# Altium schematic sheet PMSM_Driver.SchDoc
size 1249 x 800 mm; SheetNumber: 1; SheetTotal: 1
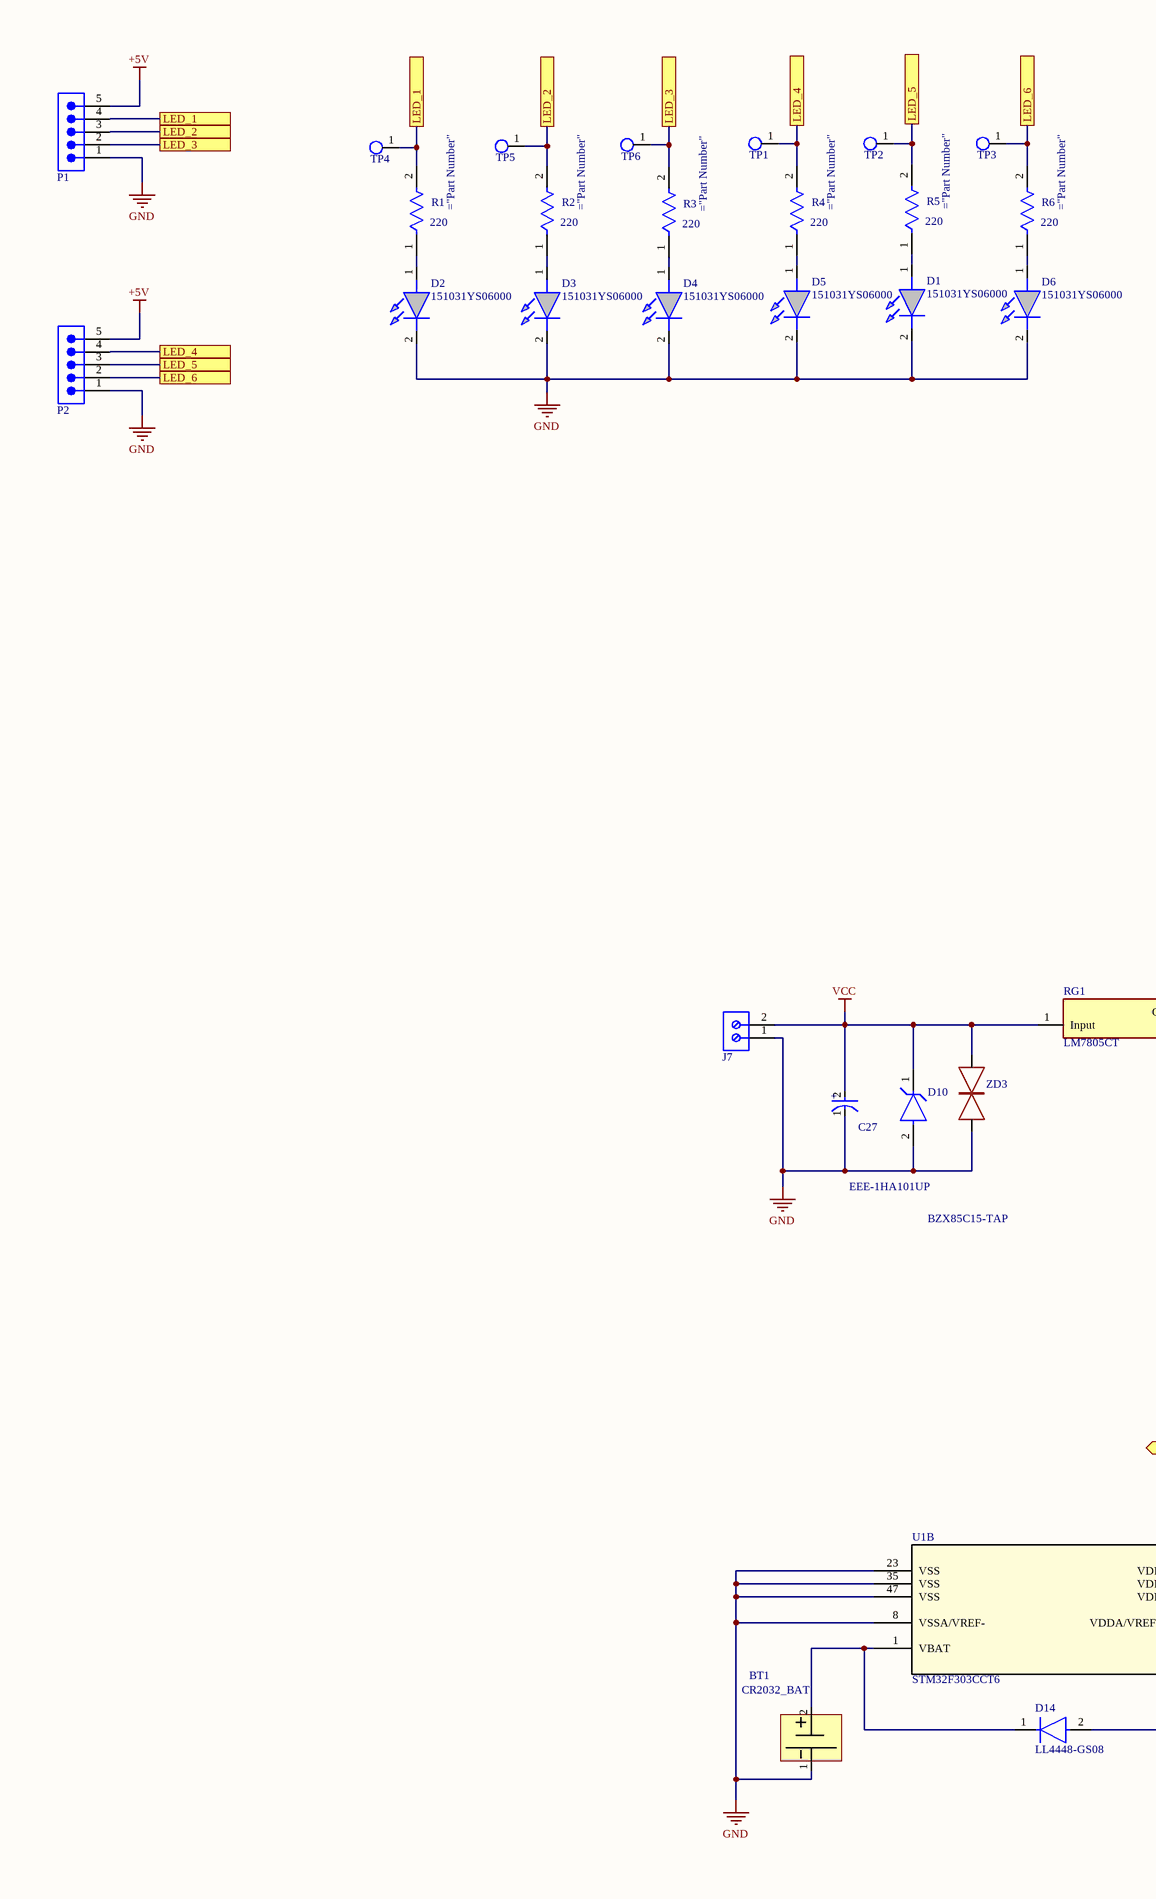
[diagram p0: PMSM_Driver.SchDoc, top column 1 of 4]
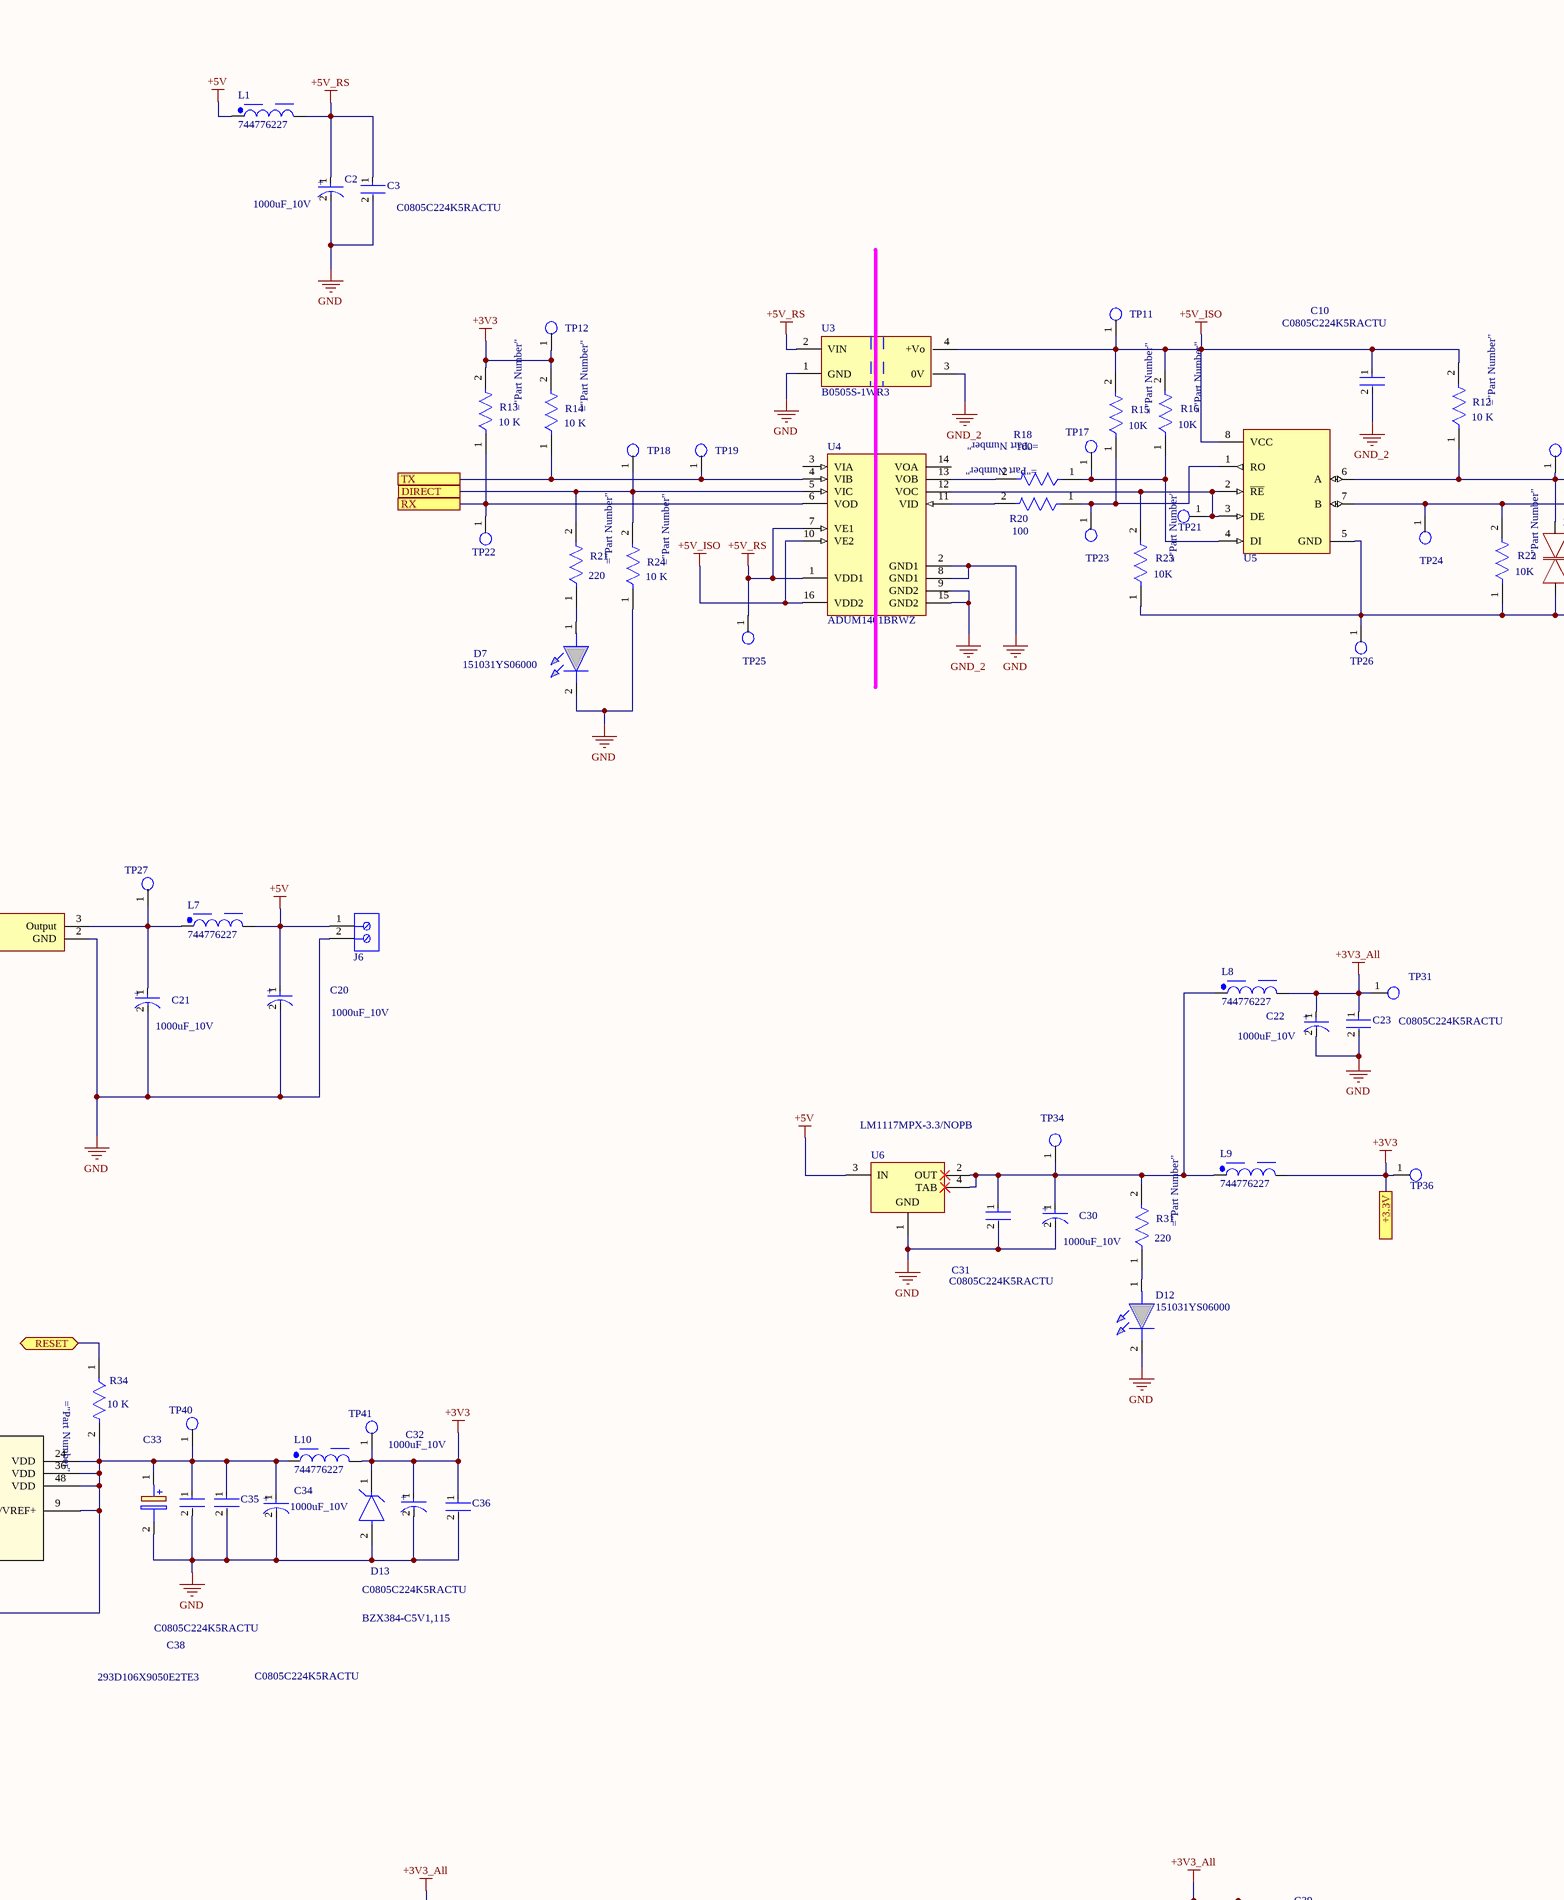
[diagram p1: PMSM_Driver.SchDoc, top column 2 of 4]
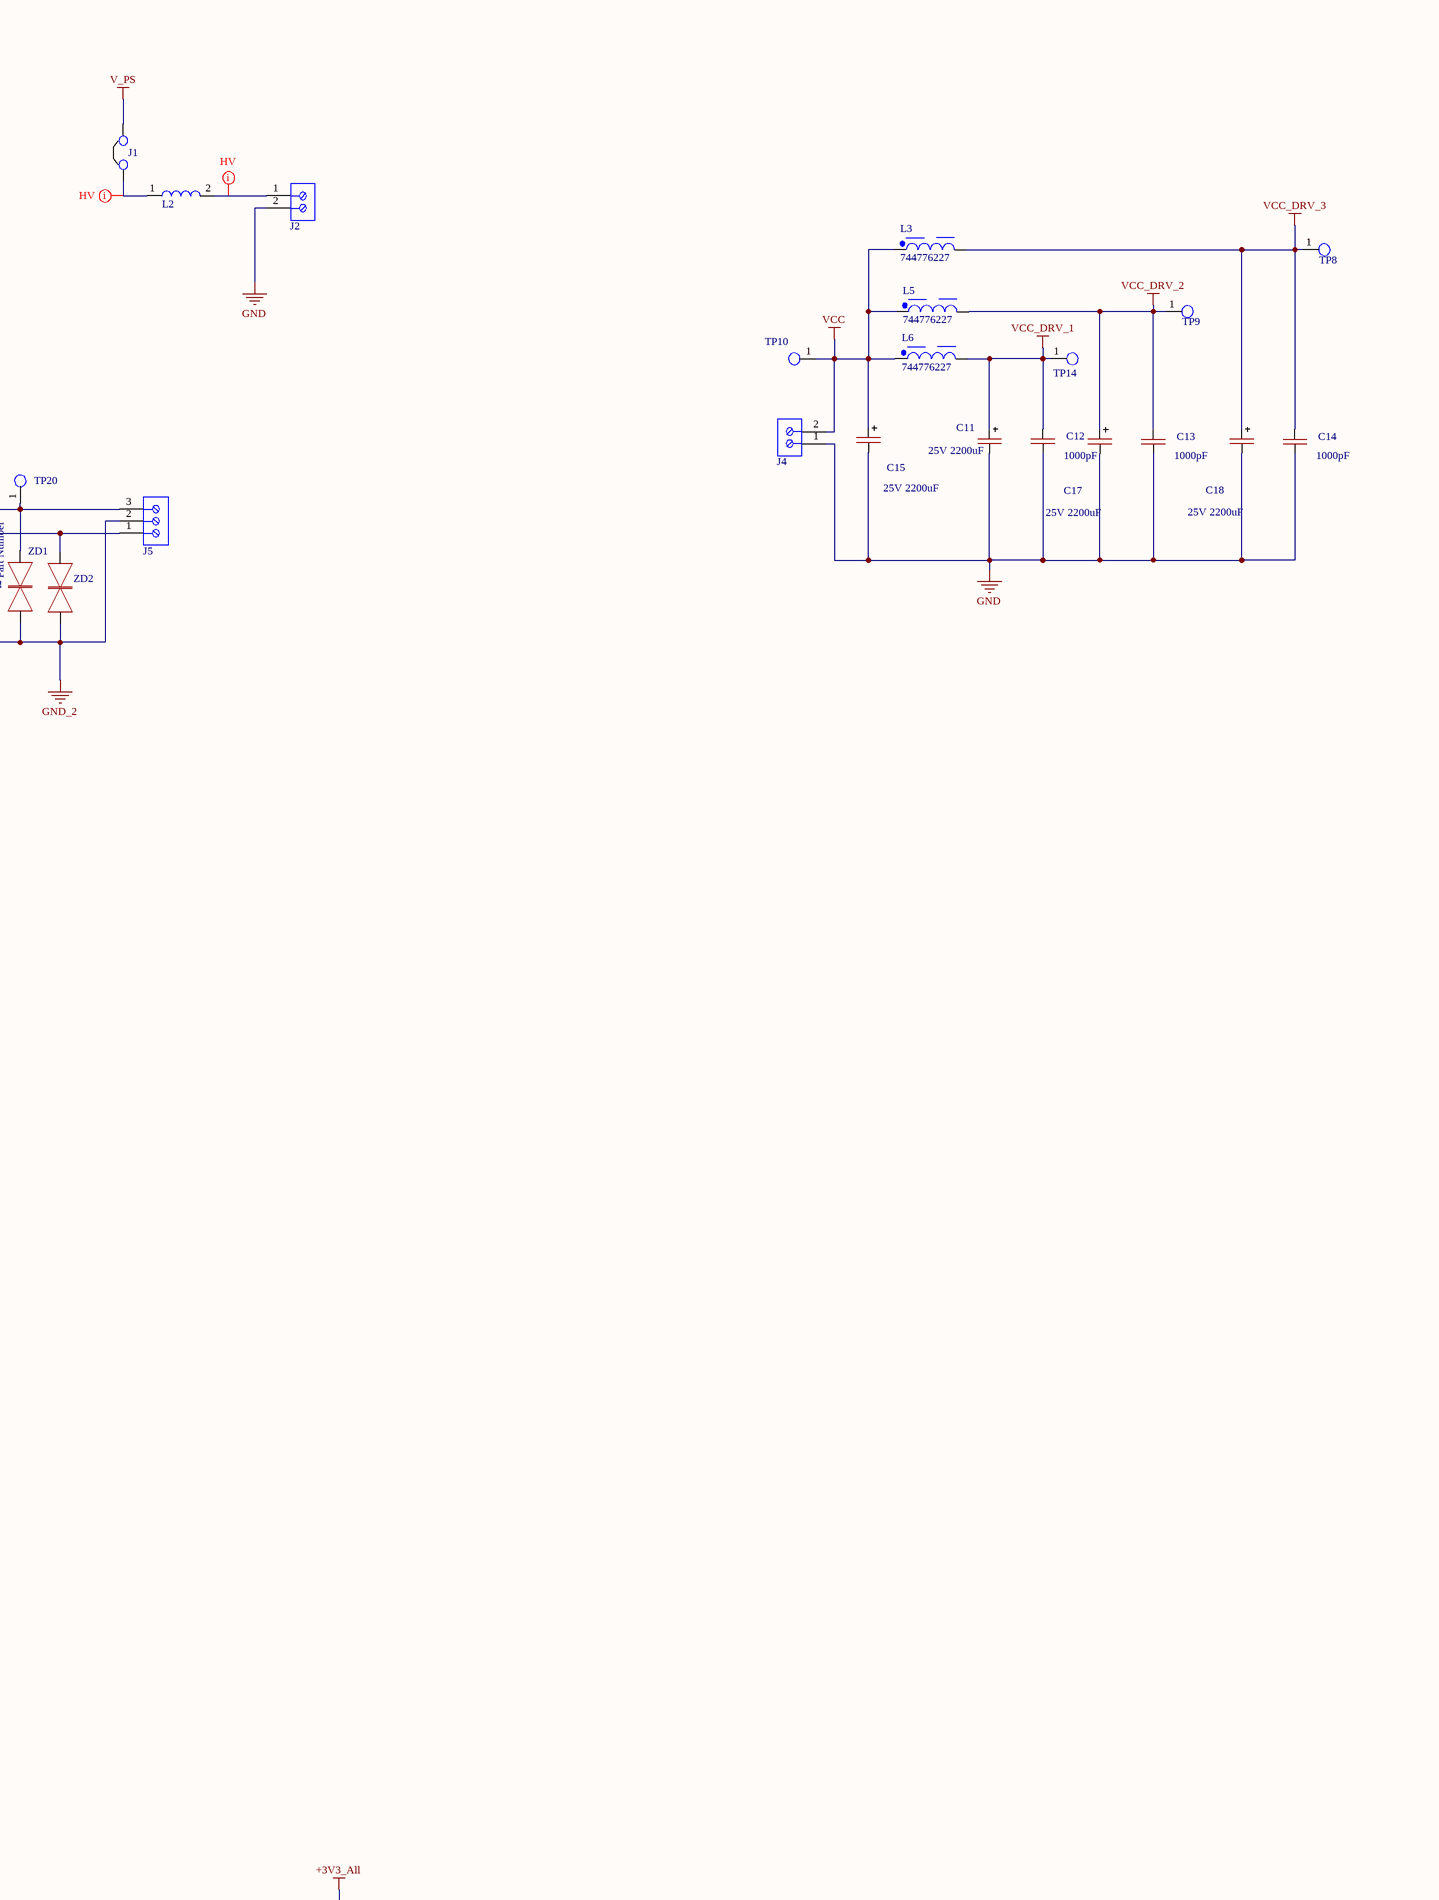
[diagram p2: PMSM_Driver.SchDoc, top column 3 of 4]
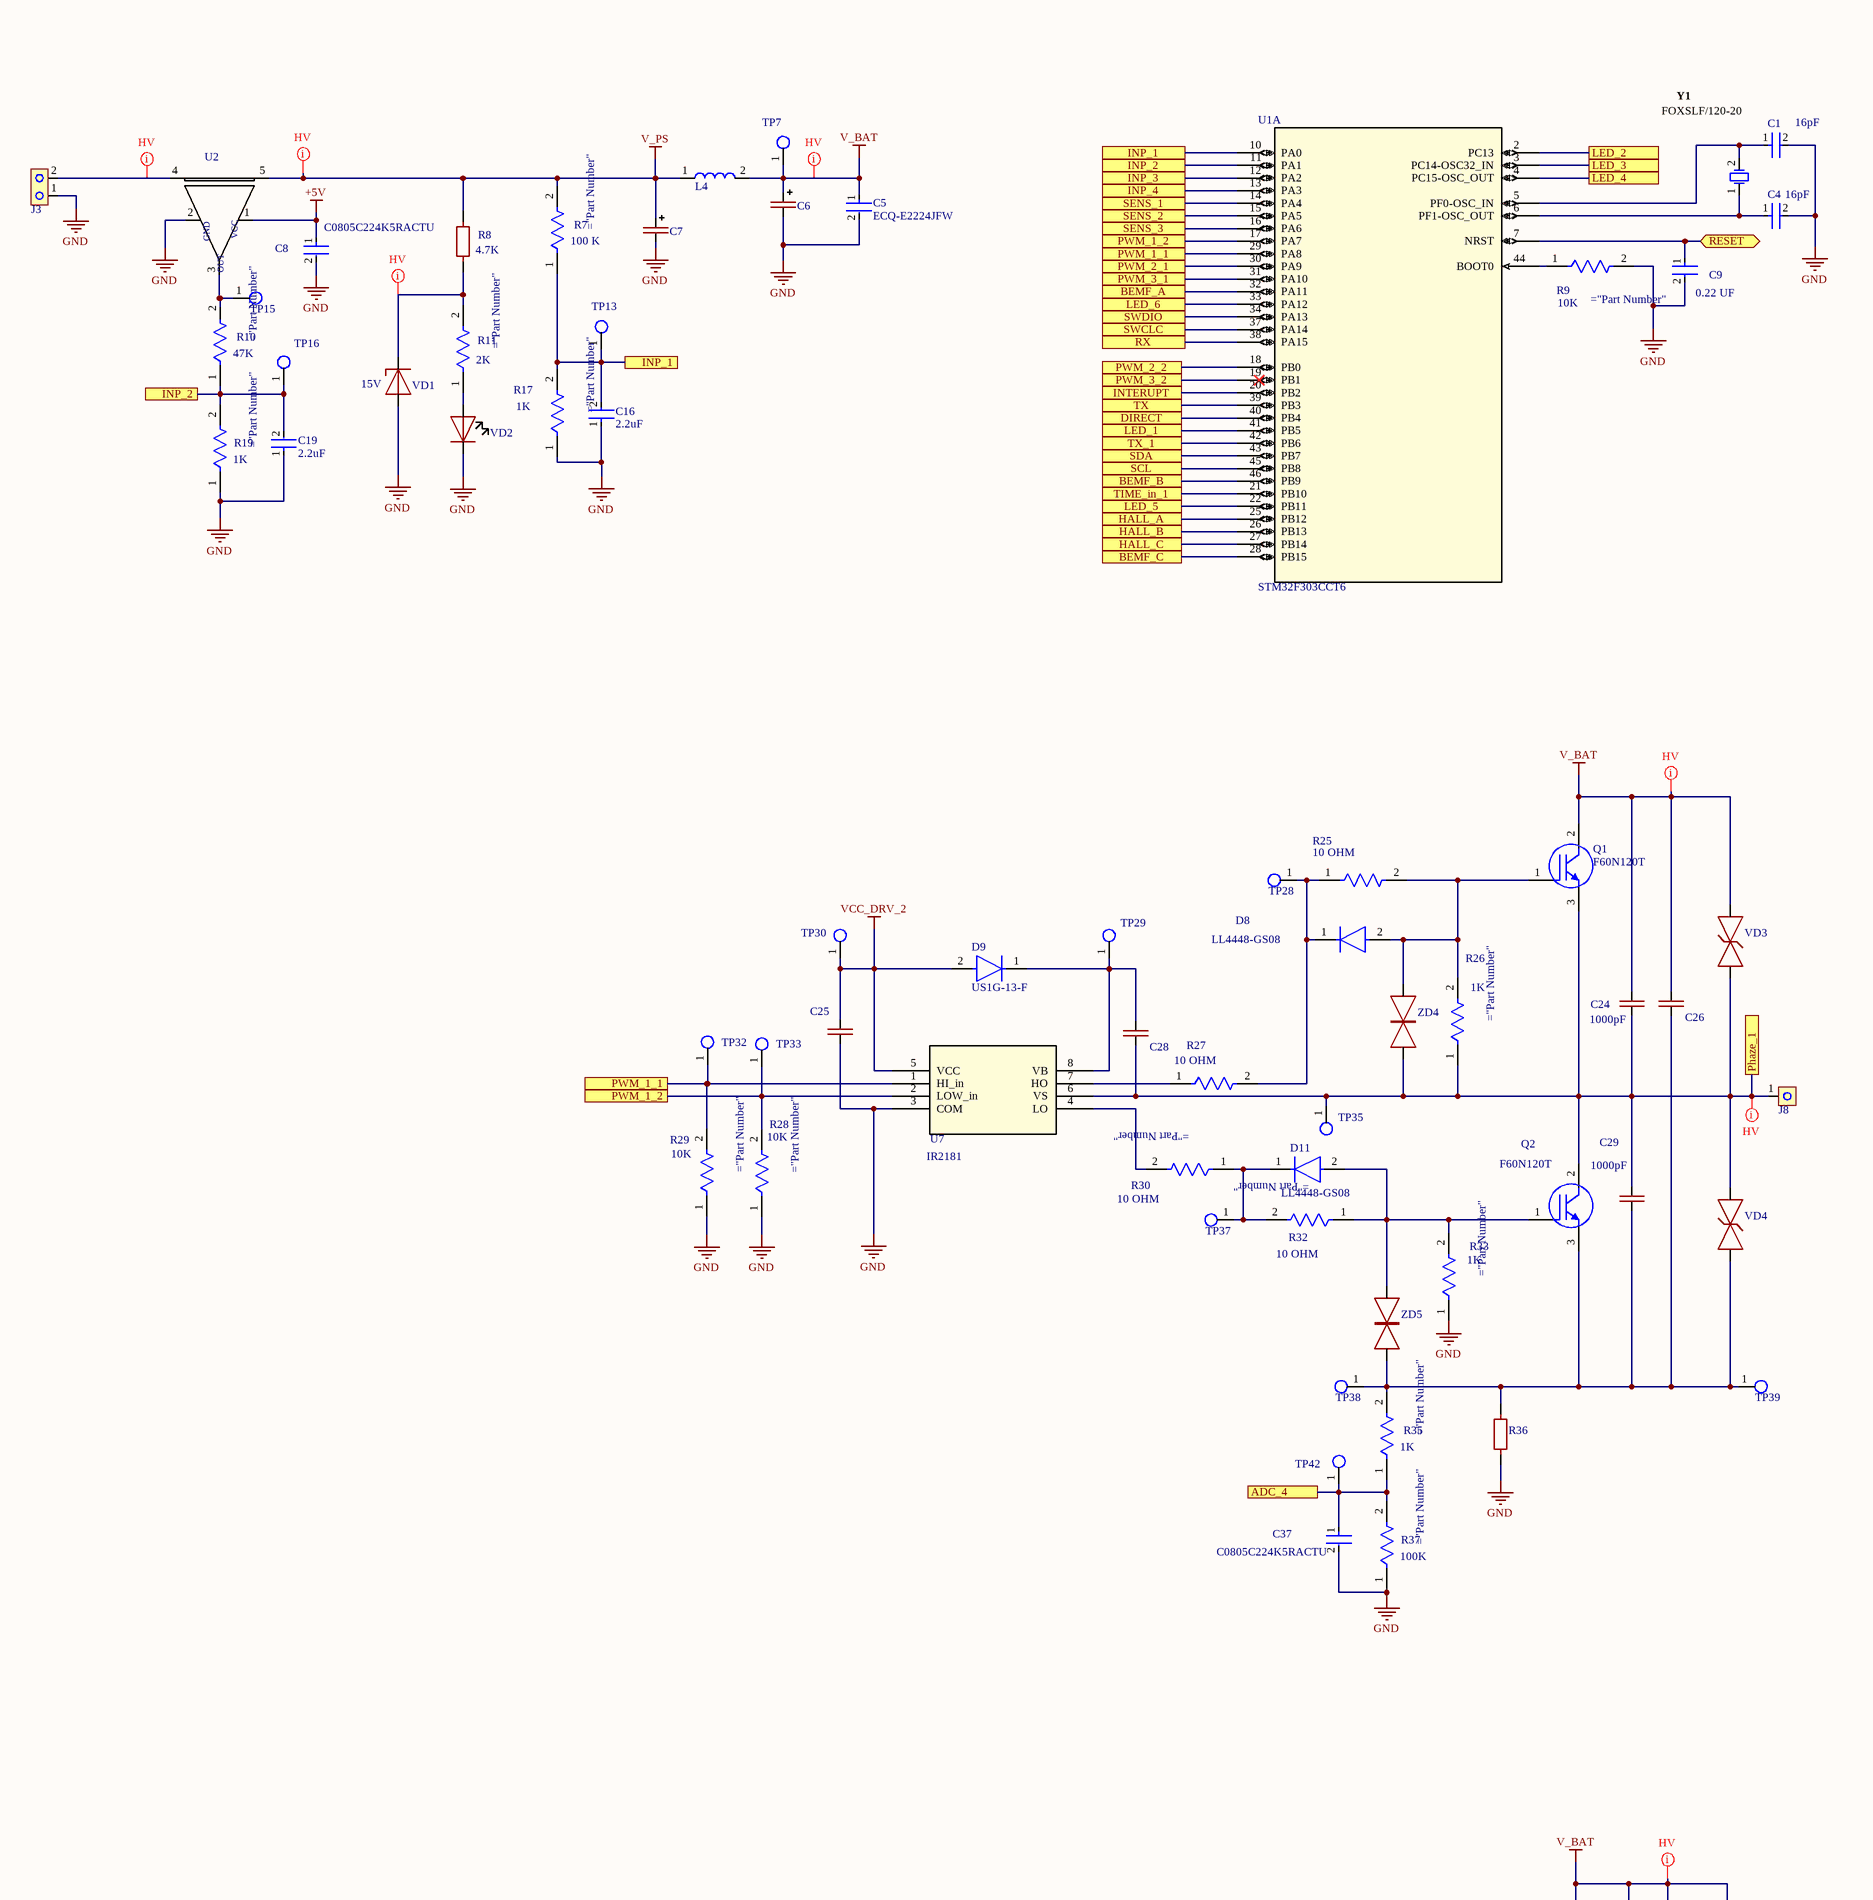
[diagram p3: PMSM_Driver.SchDoc, top column 4 of 4]
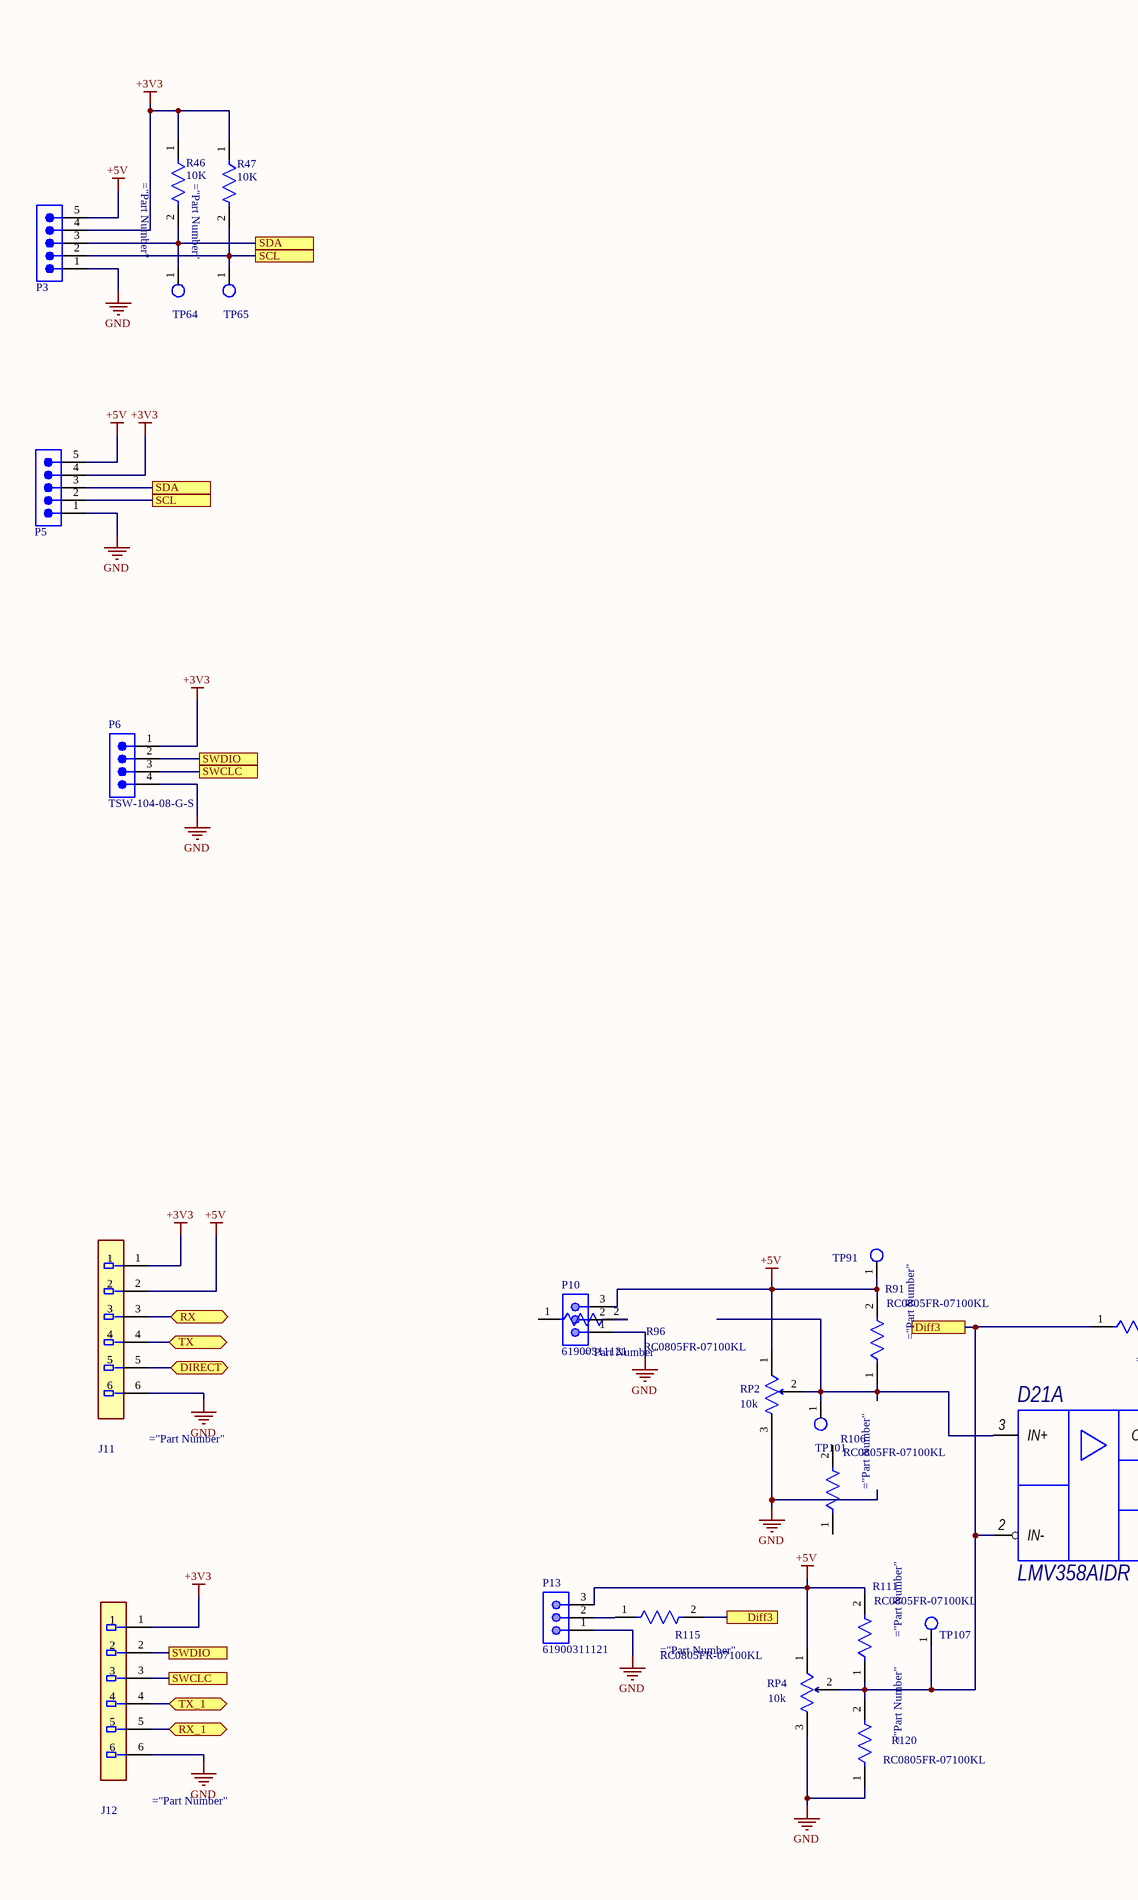
[diagram p4: PMSM_Driver.SchDoc, bottom column 1 of 4]
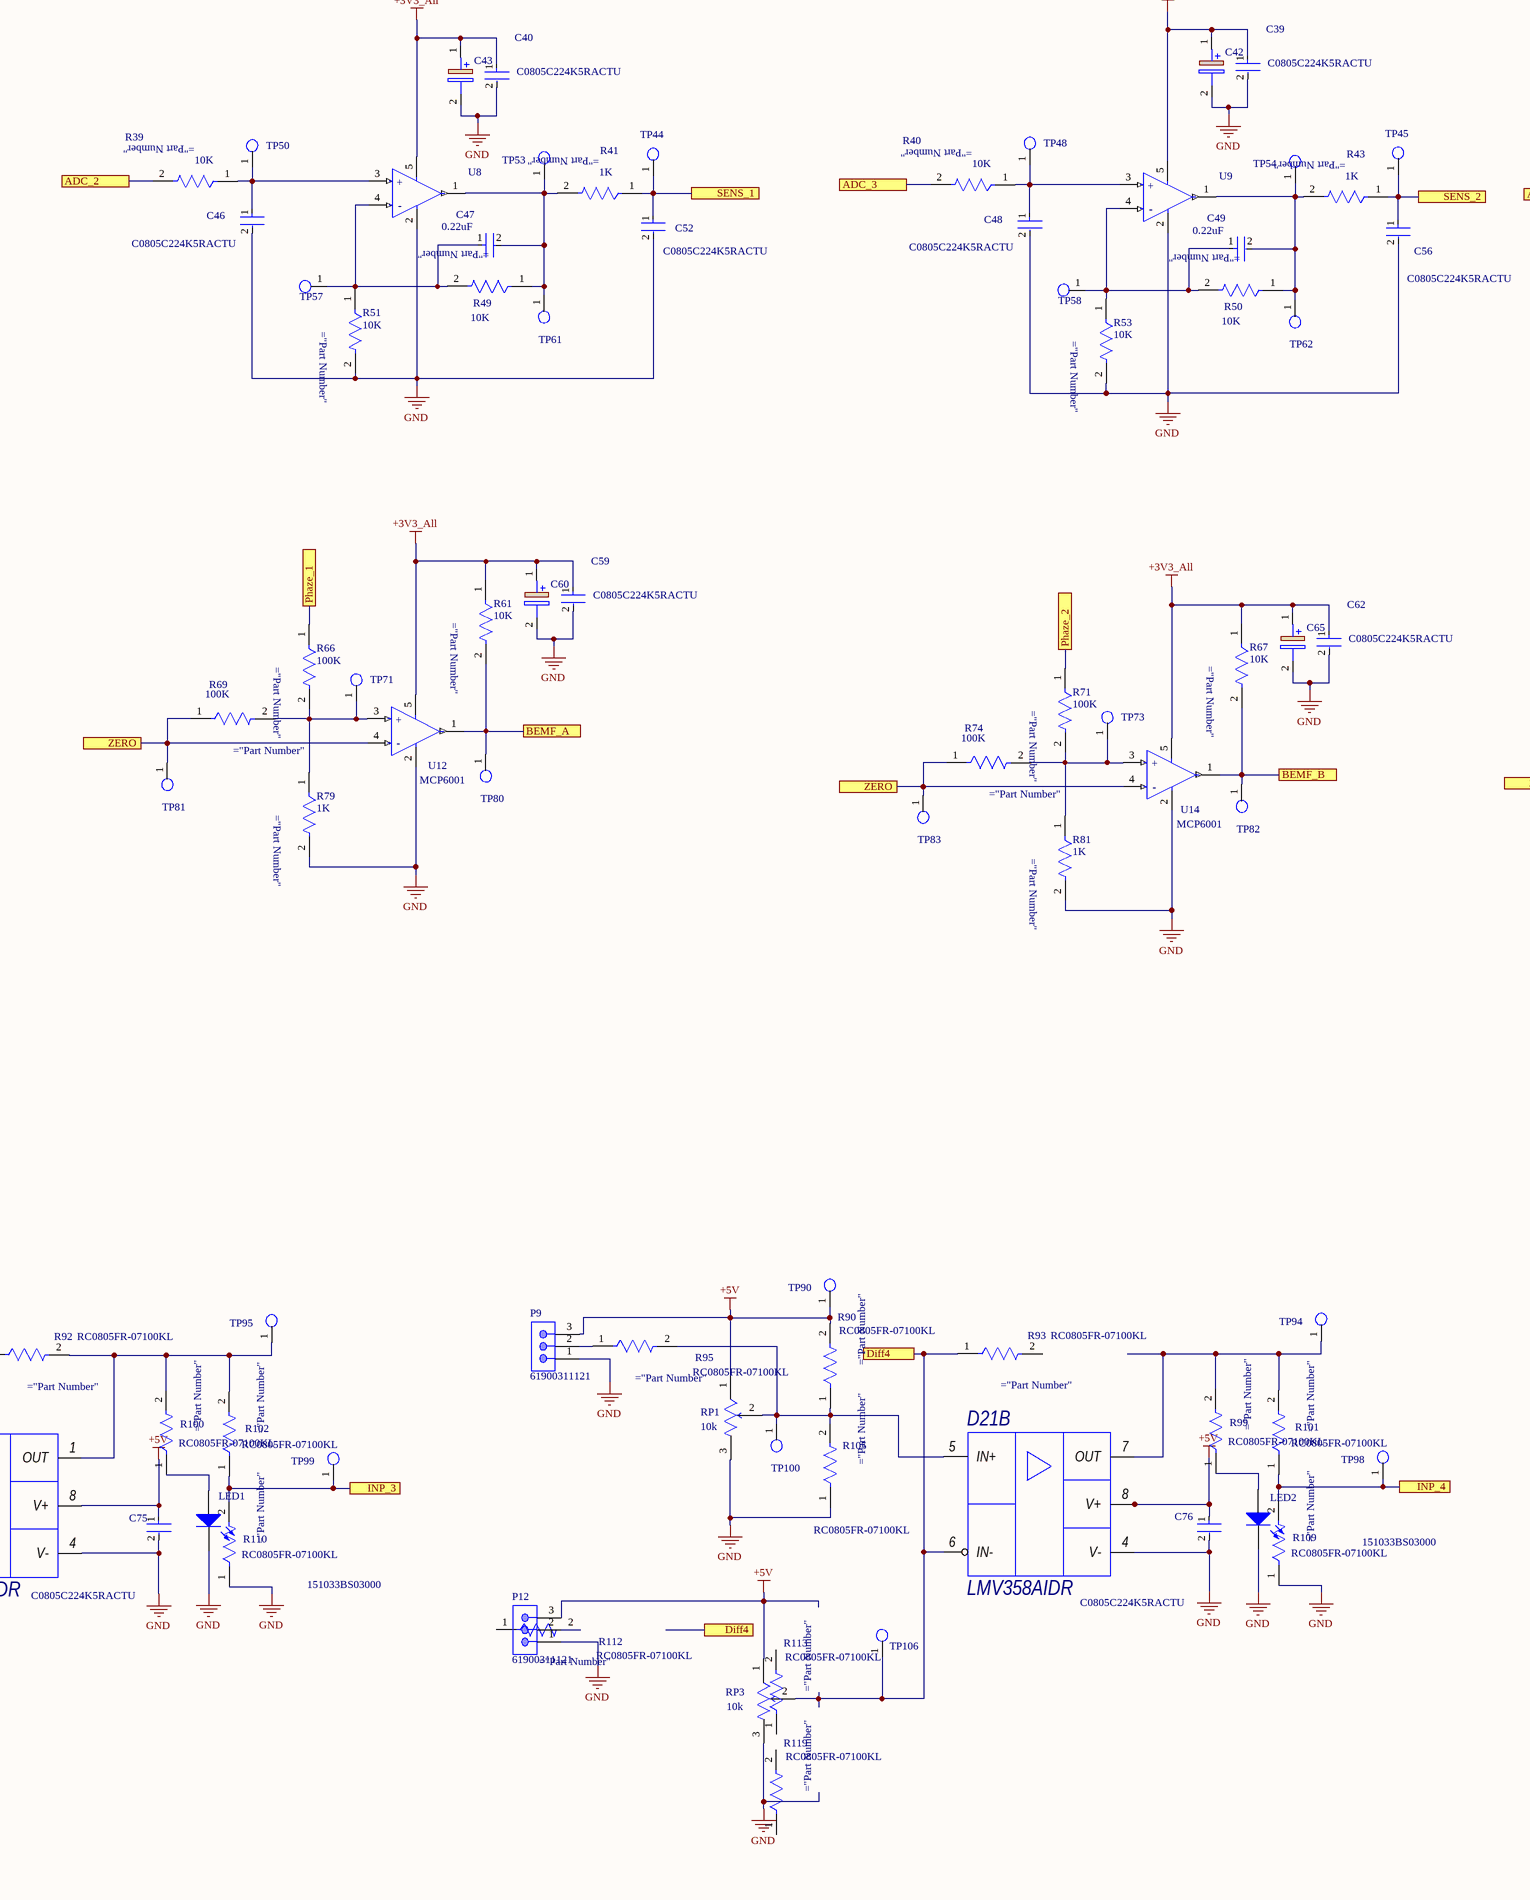
[diagram p5: PMSM_Driver.SchDoc, bottom column 2 of 4]
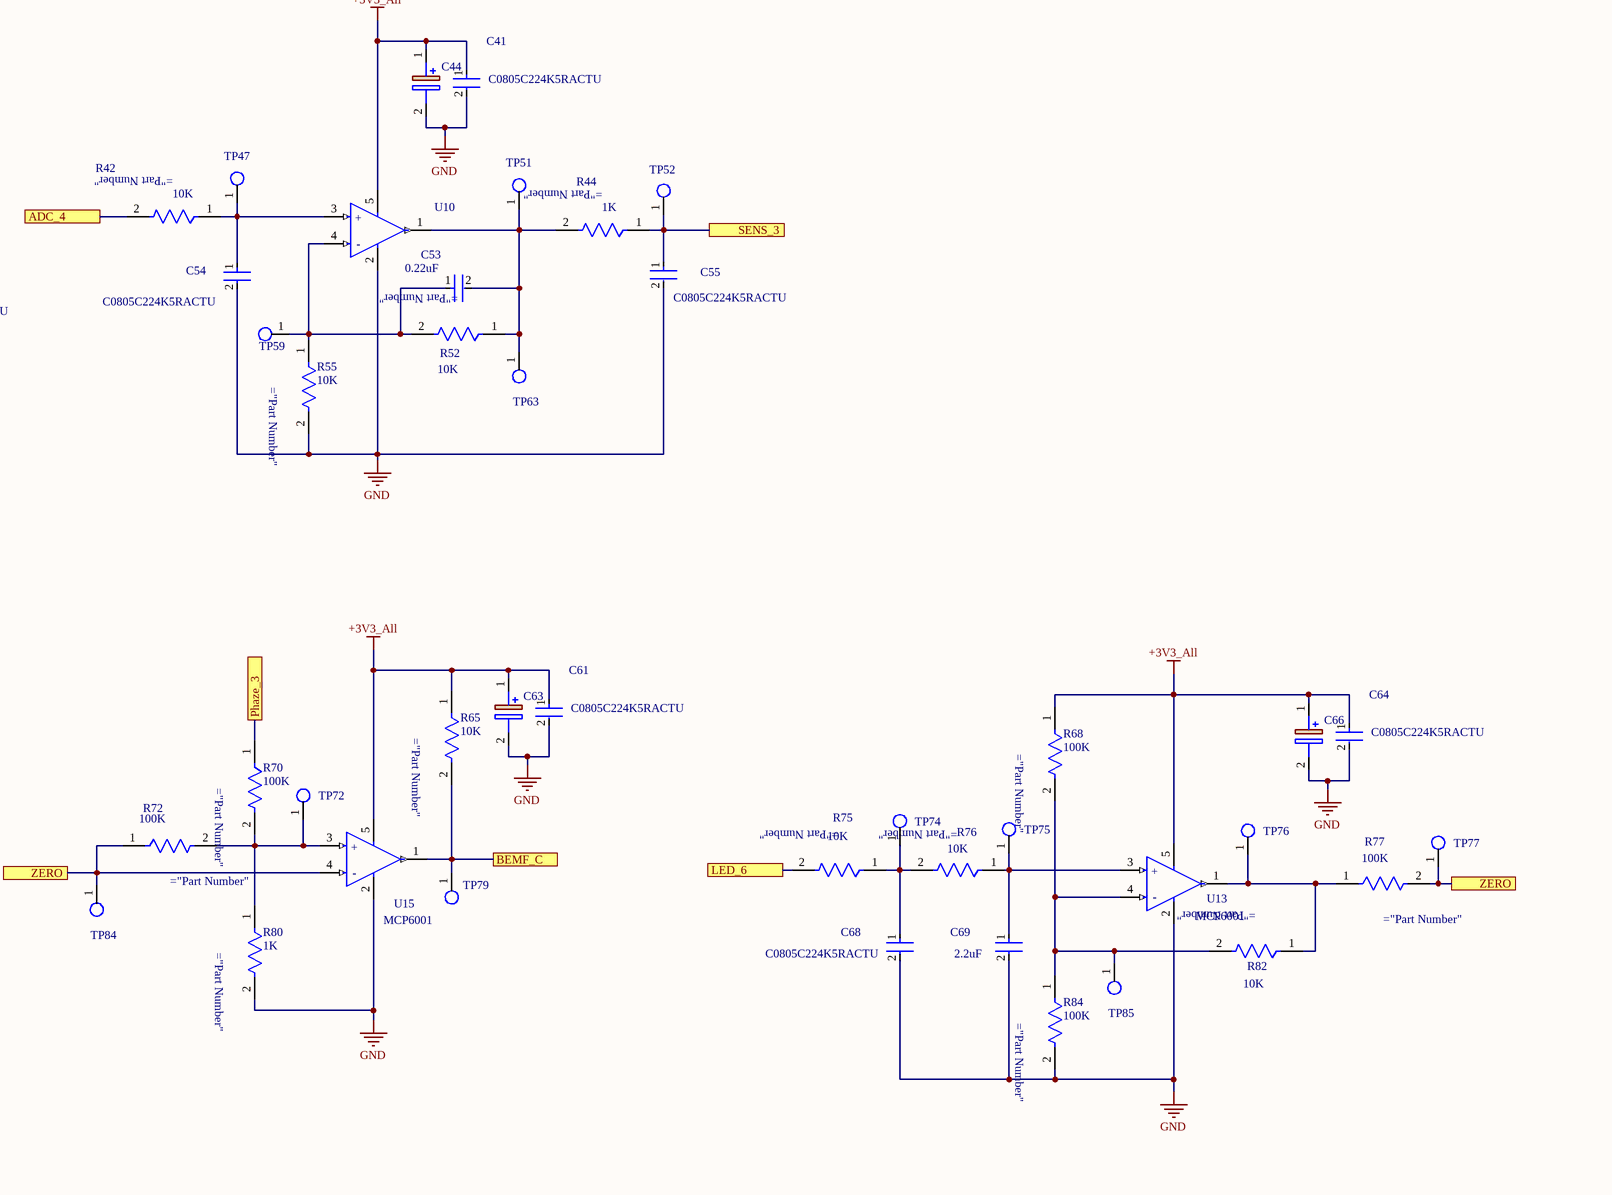
[diagram p6: PMSM_Driver.SchDoc, bottom column 3 of 4]
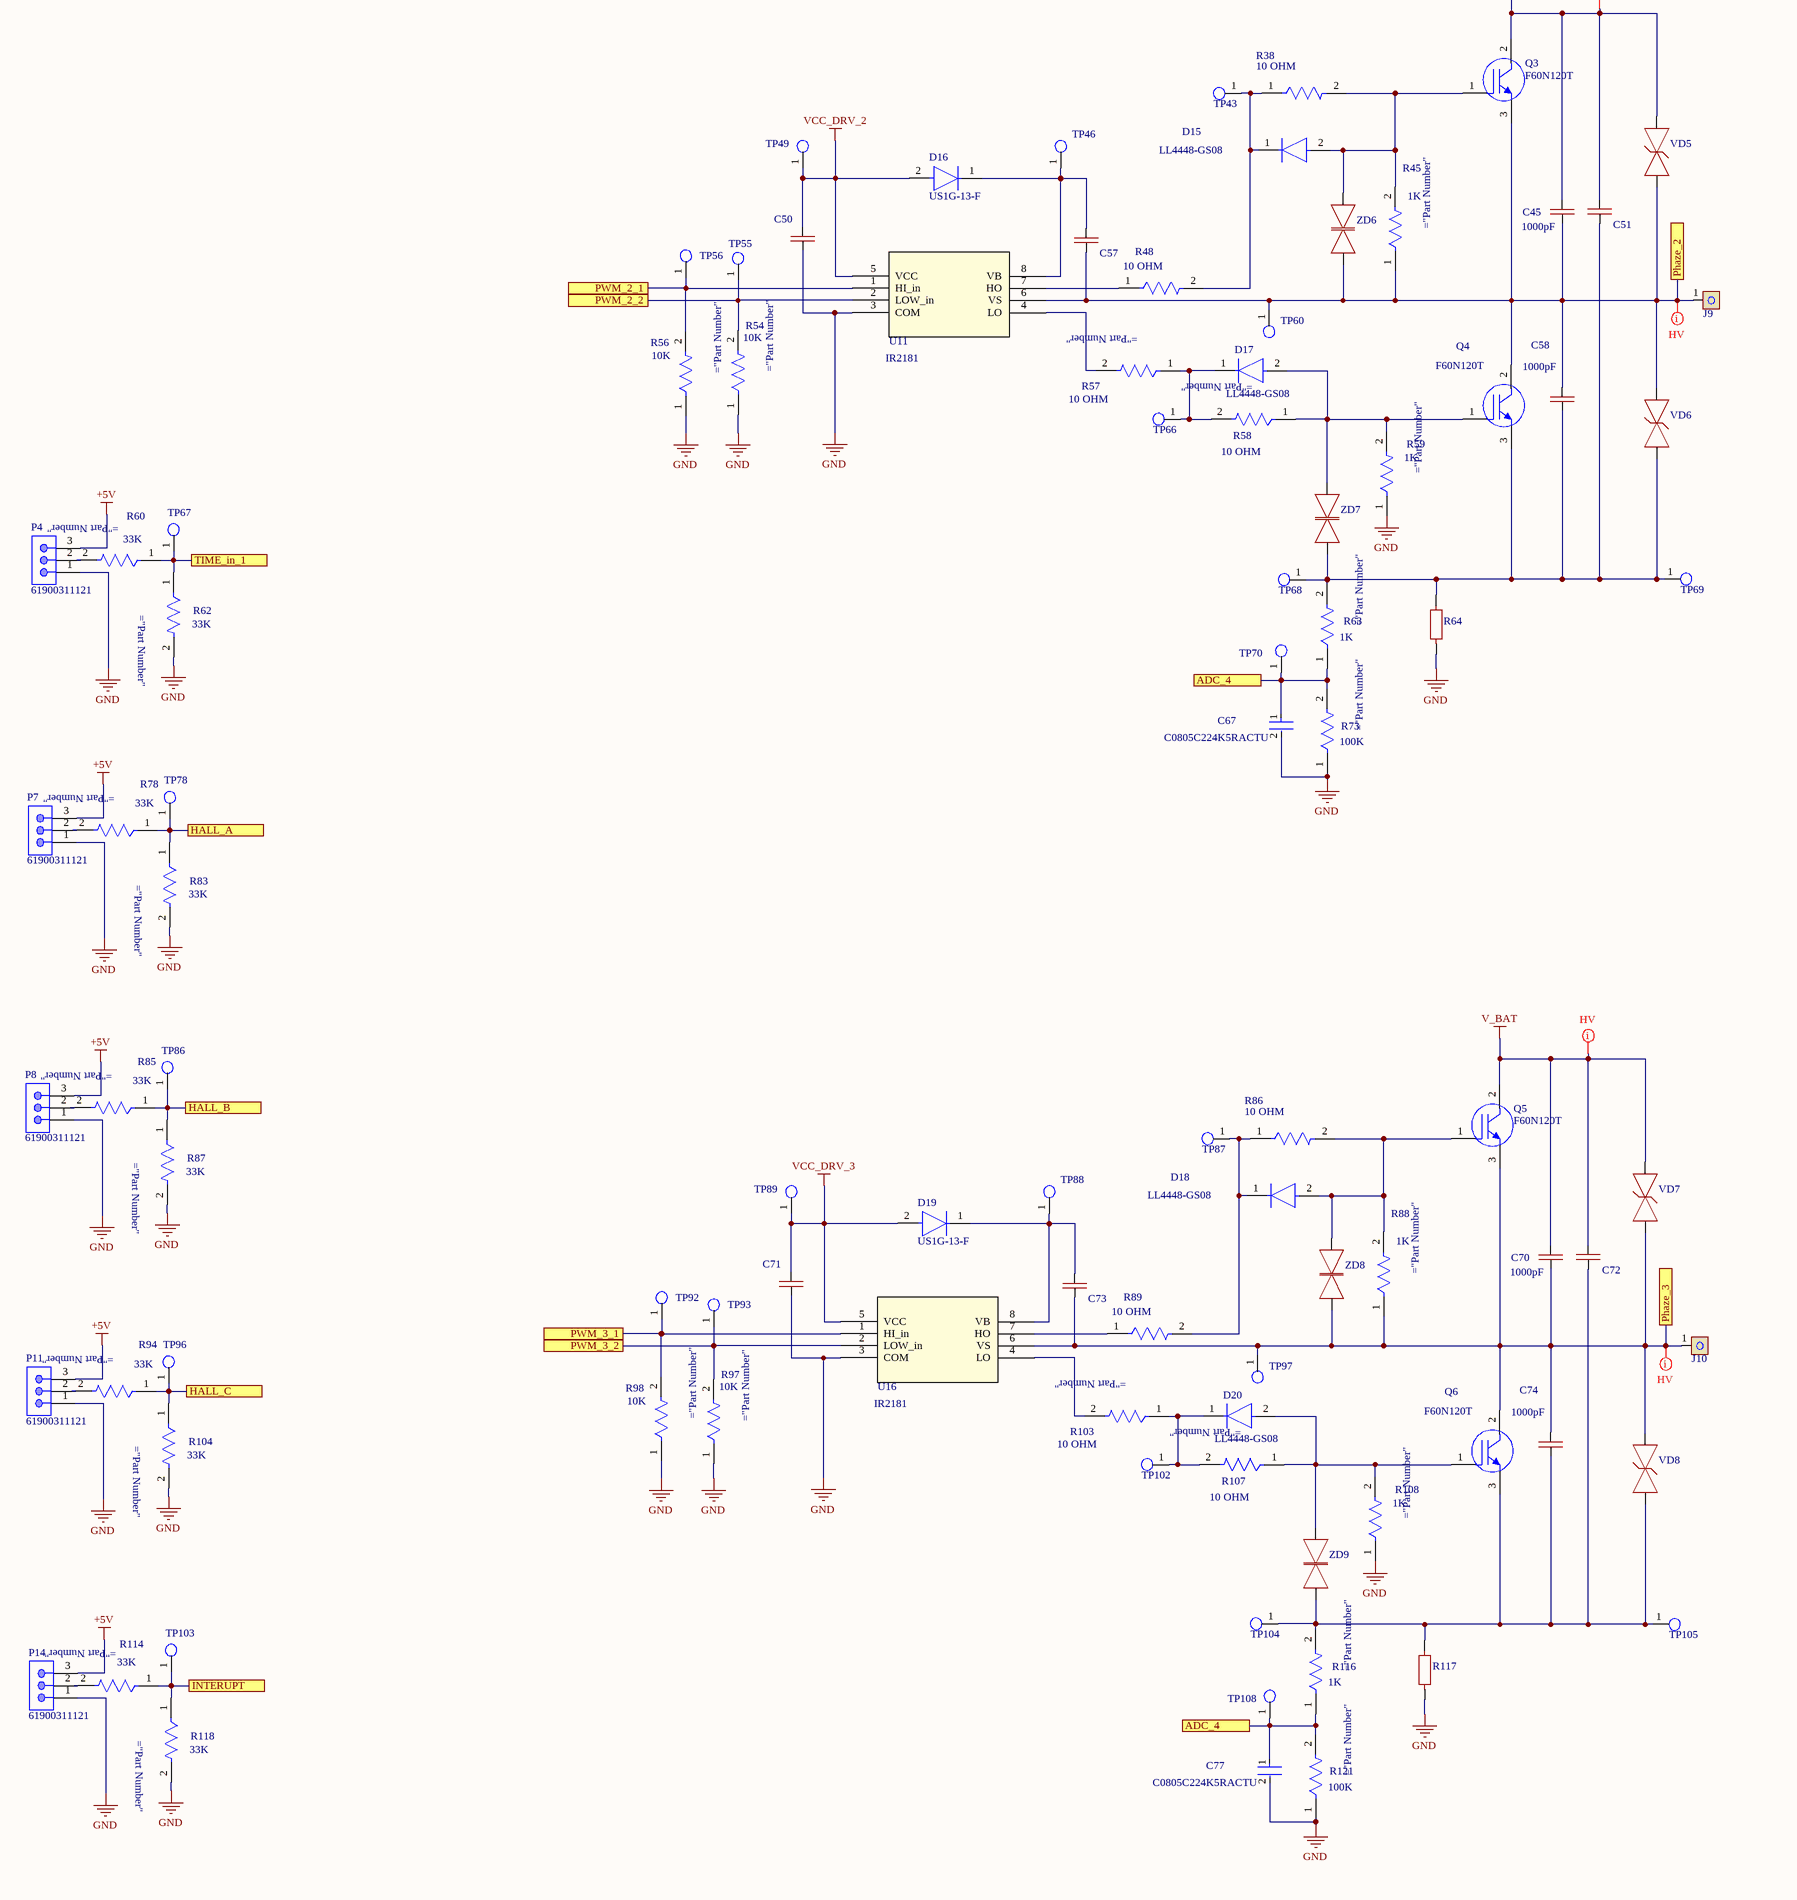
[diagram p7: PMSM_Driver.SchDoc, bottom column 4 of 4]

## Parts
BT1  CR2032_BAT  [CR2032_BAT]
C1  16pF  [FP-GRM21B-0_1-IPC_C]
C2  1000uF_10V  [1000uF_10V_Size_F]
C3  C0805C224K5RACTU  [FP-C0805C-DN-MFG]
C4  16pF  [FP-GRM21B-0_1-IPC_C]
C5  ECQ-E2224JFW  [FP-ECQ-E2224JFW-MFG]
C6  CAP-POLAR  [4700uF_100V]  (value not drawn)
C7  CAP-POLAR  [4700uF_100V]  (value not drawn)
C8  C0805C224K5RACTU  [FP-C0805C-DN-MFG]
C9  0.22 UF  [FP-C0805C-DN-MFG]
C10  C0805C224K5RACTU  [FP-C0805C-DN-MFG]
C11  25V 2200uF  [CAPPOL-12x25]
C12  1000pF  [CAP-1206]
C13  1000pF  [CAP-1206]
C14  1000pF  [CAP-1206]
C15  25V 2200uF  [CAPPOL-12x25]
C16  2.2uF  [FP-C0805C-DN-MFG]
C17  25V 2200uF  [CAPPOL-12x25]
C18  25V 2200uF  [CAPPOL-12x25]
C19  2.2uF  [FP-C0805C-DN-MFG]
C20  1000uF_10V  [1000uF_10V_Size_F]
C21  1000uF_10V  [1000uF_10V_Size_F]
C22  1000uF_10V  [1000uF_10V_Size_F]
C23  C0805C224K5RACTU  [FP-C0805C-DN-MFG]
C24  1000pF  [CAP-1206]
C25  CAP-NON-POLAR  [CAP-1206]  (value not drawn)
C26  CAP-NON-POLAR  [MKP 100nF 275VAC]  (value not drawn)
C27  EEE-1HA101UP  [FP-SF-MFG]
C28  CAP-NON-POLAR  [CAP-1206]  (value not drawn)
C29  1000pF  [CAP-1206]
C30  1000uF_10V  [1000uF_10V_Size_F]
C31  C0805C224K5RACTU  [FP-C0805C-DN-MFG]
C32  1000uF_10V  [1000uF_10V_Size_F]
C33  293D106X9050E2TE3  [CAPPM7343X430N]
C34  1000uF_10V  [1000uF_10V_Size_F]
C35  C0805C224K5RACTU  [FP-C0805C-DN-MFG]
C36  C0805C224K5RACTU  [FP-C0805C-DN-MFG]
C37  C0805C224K5RACTU  [FP-C0805C-DN-MFG]
C38  C0805C224K5RACTU  [FP-C0805C-DN-MFG]
C39  C0805C224K5RACTU  [FP-C0805C-DN-MFG]
C40  C0805C224K5RACTU  [FP-C0805C-DN-MFG]
C41  C0805C224K5RACTU  [FP-C0805C-DN-MFG]
C42  293D106X9050E2TE3  [CAPPM7343X430N]  (value not drawn)
C43  293D106X9050E2TE3  [CAPPM7343X430N]  (value not drawn)
C44  293D106X9050E2TE3  [CAPPM7343X430N]  (value not drawn)
C45  1000pF  [CAP-1206]
C46  C0805C224K5RACTU  [FP-C0805C-DN-MFG]
C47  0.22uF  [FP-C0805C-DN-MFG]
C48  C0805C224K5RACTU  [FP-C0805C-DN-MFG]
C49  0.22uF  [FP-C0805C-DN-MFG]
C50  CAP-NON-POLAR  [CAP-1206]  (value not drawn)
C51  CAP-NON-POLAR  [MKP 100nF 275VAC]  (value not drawn)
C52  C0805C224K5RACTU  [FP-C0805C-DN-MFG]
C53  0.22uF  [FP-C0805C-DN-MFG]
C54  C0805C224K5RACTU  [FP-C0805C-DN-MFG]
C55  C0805C224K5RACTU  [FP-C0805C-DN-MFG]
C56  C0805C224K5RACTU  [FP-C0805C-DN-MFG]
C57  CAP-NON-POLAR  [CAP-1206]  (value not drawn)
C58  1000pF  [CAP-1206]
C59  C0805C224K5RACTU  [FP-C0805C-DN-MFG]
C60  293D106X9050E2TE3  [CAPPM7343X430N]  (value not drawn)
C61  C0805C224K5RACTU  [FP-C0805C-DN-MFG]
C62  C0805C224K5RACTU  [FP-C0805C-DN-MFG]
C63  293D106X9050E2TE3  [CAPPM7343X430N]  (value not drawn)
C64  C0805C224K5RACTU  [FP-C0805C-DN-MFG]
C65  293D106X9050E2TE3  [CAPPM7343X430N]  (value not drawn)
C66  293D106X9050E2TE3  [CAPPM7343X430N]  (value not drawn)
C67  C0805C224K5RACTU  [FP-C0805C-DN-MFG]
C68  C0805C224K5RACTU  [FP-C0805C-DN-MFG]
C69  2.2uF  [FP-C0805C-DN-MFG]
C70  1000pF  [CAP-1206]
C71  CAP-NON-POLAR  [CAP-1206]  (value not drawn)
C72  CAP-NON-POLAR  [MKP 100nF 275VAC]  (value not drawn)
C73  CAP-NON-POLAR  [CAP-1206]  (value not drawn)
C74  1000pF  [CAP-1206]
C75  C0805C224K5RACTU  [FP-C0805C-DN-MFG]
C76  C0805C224K5RACTU  [FP-C0805C-DN-MFG]
C77  C0805C224K5RACTU  [FP-C0805C-DN-MFG]
D1  151031YS06000  [LED_BLUE]
D2  151031YS06000  [LED_Yellow]
D3  151031YS06000  [LED_GREEN]
D4  151031YS06000  [LED_BLUE]
D5  151031YS06000  [LED_BLUE]
D6  151031YS06000  [LED_BLUE]
D7  151031YS06000  [LED_BLUE]
D8  LL4448-GS08  [FP-6_560-5005_01-4-MFG]
D9  US1G-13-F  [FP-SMA-MFG]
D10  BZX85C15-TAP  [FP-6_561-5001_02-4-MFG]
D11  LL4448-GS08  [FP-6_560-5005_01-4-MFG]
D12  151031YS06000  [LED_Yellow]
D13  BZX384-C5V1,115  [FP-SOD323-MFG]
D14  LL4448-GS08  [FP-6_560-5005_01-4-MFG]
D15  LL4448-GS08  [FP-6_560-5005_01-4-MFG]
D16  US1G-13-F  [FP-SMA-MFG]
D17  LL4448-GS08  [FP-6_560-5005_01-4-MFG]
D18  LL4448-GS08  [FP-6_560-5005_01-4-MFG]
D19  US1G-13-F  [FP-SMA-MFG]
D20  LL4448-GS08  [FP-6_560-5005_01-4-MFG]
D21  LMV358AIDR  [8-SOIC]  (parts A,B of 2)
J1  Jumper 1x2.54  [Jumper_2.54]  (value not drawn)
J2  691101710002  [691101710002]  (value not drawn)
J3  TL-800  [Conn_Tianli_T-800]  (value not drawn)
J4  691101710002  [691101710002]  (value not drawn)
J5  691101710003  [691101710003]  (value not drawn)
J6  691101710002  [691101710002]  (value not drawn)
J7  691101710002  [691101710002]  (value not drawn)
J8  MG_136_HT  [Conn_MEIGAN_MG136HT]  (value not drawn)
J9  MG_136_HT  [Conn_MEIGAN_MG136HT]  (value not drawn)
J10  MG_136_HT  [Conn_MEIGAN_MG136HT]  (value not drawn)
J11  SWR25X-NRTC-S06-ST-BA  [Sullins_SWR25X-NRTC-S06-ST-BA_MFG]  (value not drawn)
J12  SWR25X-NRTC-S06-ST-BA  [Sullins_SWR25X-NRTC-S06-ST-BA_MFG]  (value not drawn)
L1  744776227  [WE-PD2_1054]
L2  Coil  [Coil_drosel]  (value not drawn)
L3  744776227  [WE-PD2_1054]
L4  Coil  [Coil_drosel]  (value not drawn)
L5  744776227  [WE-PD2_1054]
L6  744776227  [WE-PD2_1054]
L7  744776227  [WE-PD2_1054]
L8  744776227  [WE-PD2_1054]
L9  744776227  [WE-PD2_1054]
L10  744776227  [WE-PD2_1054]
LED1  151033BS03000  [Type 3mm]
LED2  151033BS03000  [Type 3mm]
P1  61300511121  [61300511121]  (value not drawn)
P2  61300511121  [61300511121]  (value not drawn)
P3  61300511121  [61300511121]  (value not drawn)
P4  61900311121  [61900311121]
P5  61300511121  [61300511121]  (value not drawn)
P6  TSW-104-08-G-S  [SMTC-TSW-104-08-X-S]
P7  61900311121  [61900311121]
P8  61900311121  [61900311121]
P9  61900311121  [61900311121]
P10  61900311121  [61900311121]
P11  61900311121  [61900311121]
P12  61900311121  [61900311121]
P13  61900311121  [61900311121]
P14  61900311121  [61900311121]
Q1  F60N120T  [TO-264-3]
Q2  F60N120T  [TO-264-3]
Q3  F60N120T  [TO-264-3]
Q4  F60N120T  [TO-264-3]
Q5  F60N120T  [TO-264-3]
Q6  F60N120T  [TO-264-3]
R1  220  [Yageo_RC0805_IPC_C]
R2  220  [Yageo_RC0805_IPC_A]
R3  220  [Yageo_RC0805_IPC_A]
R4  220  [Yageo_RC0805_IPC_A]
R5  220  [Yageo_RC0805_IPC_A]
R6  220  [Yageo_RC0805_IPC_A]
R7  100 K  [Yageo_RC0805_IPC_A]
R8  4.7K  [RES-2512]
R9  10K  [Yageo_RC0805_IPC_A]
R10  47K  [Yageo_RC0805_IPC_A]
R11  2K  [Yageo_RC0805_IPC_A]
R12  10 K  [Yageo_RC0805_IPC_A]
R13  10 K  [Yageo_RC0805_IPC_A]
R14  10 K  [Yageo_RC0805_IPC_A]
R15  10K  [Yageo_RC0805_IPC_A]
R16  10K  [Yageo_RC0805_IPC_A]
R17  1K  [Yageo_RC0805_IPC_A]
R18  100  [Yageo_RC0805_IPC_A]
R19  1K  [Yageo_RC0805_IPC_A]
R20  100  [Yageo_RC0805_IPC_A]
R21  220  [Yageo_RC0805_IPC_A]
R22  10K  [Yageo_RC0805_IPC_C]
R23  10K  [Yageo_RC0805_IPC_A]
R24  10 K  [Yageo_RC0805_IPC_A]
R25  10 OHM  [FP-RT0805-IPC_C]
R26  1K  [Yageo_RC0805_IPC_A]
R27  10 OHM  [FP-RT0805-MFG]
R28  10K  [Yageo_RC0805_IPC_A]
R29  10K  [Yageo_RC0805_IPC_A]
R30  10 OHM  [Yageo_RC0805_IPC_A]
R31  220  [Yageo_RC0805_IPC_A]
R32  10 OHM  [Yageo_RC0805_IPC_A]
R33  1K  [Yageo_RC0805_IPC_A]
R34  10 K  [Yageo_RC0805_IPC_A]
R35  1K  [Yageo_RC0805_IPC_C]
R36  RES-CONST  [RES-3921]  (value not drawn)
R37  100K  [Yageo_RC0805_IPC_A]
R38  10 OHM  [FP-RT0805-IPC_C]
R39  10K  [Yageo_RC0805_IPC_C]
R40  10K  [Yageo_RC0805_IPC_C]
R41  1K  [Yageo_RC0805_IPC_C]
R42  10K  [Yageo_RC0805_IPC_C]
R43  1K  [Yageo_RC0805_IPC_C]
R44  1K  [Yageo_RC0805_IPC_C]
R45  1K  [Yageo_RC0805_IPC_A]
R46  10K  [Yageo_RC0805_IPC_C]
R47  10K  [Yageo_RC0805_IPC_C]
R48  10 OHM  [FP-RT0805-MFG]
R49  10K  [Yageo_RC0805_IPC_C]
R50  10K  [Yageo_RC0805_IPC_C]
R51  10K  [Yageo_RC0805_IPC_C]
R52  10K  [Yageo_RC0805_IPC_C]
R53  10K  [Yageo_RC0805_IPC_C]
R54  10K  [Yageo_RC0805_IPC_A]
R55  10K  [Yageo_RC0805_IPC_C]
R56  10K  [Yageo_RC0805_IPC_A]
R57  10 OHM  [Yageo_RC0805_IPC_A]
R58  10 OHM  [Yageo_RC0805_IPC_A]
R59  1K  [Yageo_RC0805_IPC_A]
R60  33K  [Yageo_RC0805_IPC_A]
R61  10K  [Yageo_RC0805_IPC_C]
R62  33K  [Yageo_RC0805_IPC_A]
R63  1K  [Yageo_RC0805_IPC_C]
R64  RES-CONST  [RES-3921]  (value not drawn)
R65  10K  [Yageo_RC0805_IPC_C]
R66  100K  [Yageo_RC0805_IPC_C]
R67  10K  [Yageo_RC0805_IPC_C]
R68  100K  [Yageo_RC0805_IPC_C]
R69  100K  [Yageo_RC0805_IPC_C]
R70  100K  [Yageo_RC0805_IPC_C]
R71  100K  [Yageo_RC0805_IPC_C]
R72  100K  [Yageo_RC0805_IPC_C]
R73  100K  [Yageo_RC0805_IPC_A]
R74  100K  [Yageo_RC0805_IPC_C]
R75  10K  [Yageo_RC0805_IPC_C]
R76  10K  [Yageo_RC0805_IPC_C]
R77  100K  [Yageo_RC0805_IPC_C]
R78  33K  [Yageo_RC0805_IPC_A]
R79  1K  [Yageo_RC0805_IPC_C]
R80  1K  [Yageo_RC0805_IPC_C]
R81  1K  [Yageo_RC0805_IPC_C]
R82  10K  [Yageo_RC0805_IPC_C]
R83  33K  [Yageo_RC0805_IPC_A]
R84  100K  [Yageo_RC0805_IPC_C]
R85  33K  [Yageo_RC0805_IPC_A]
R86  10 OHM  [FP-RT0805-IPC_C]
R87  33K  [Yageo_RC0805_IPC_A]
R88  1K  [Yageo_RC0805_IPC_A]
R89  10 OHM  [FP-RT0805-MFG]
R90  RC0805FR-07100KL  [Yageo_RC0805_IPC_A]
R91  RC0805FR-07100KL  [Yageo_RC0805_IPC_A]
R92  RC0805FR-07100KL  [Yageo_RC0805_IPC_A]
R93  RC0805FR-07100KL  [Yageo_RC0805_IPC_A]
R94  33K  [Yageo_RC0805_IPC_A]
R95  RC0805FR-07100KL  [Yageo_RC0805_IPC_A]
R96  RC0805FR-07100KL  [Yageo_RC0805_IPC_A]
R97  10K  [Yageo_RC0805_IPC_A]
R98  10K  [Yageo_RC0805_IPC_A]
R99  RC0805FR-07100KL  [Yageo_RC0805_IPC_A]
R100  RC0805FR-07100KL  [Yageo_RC0805_IPC_A]
R101  RC0805FR-07100KL  [Yageo_RC0805_IPC_A]
R102  RC0805FR-07100KL  [Yageo_RC0805_IPC_A]
R103  10 OHM  [Yageo_RC0805_IPC_A]
R104  33K  [Yageo_RC0805_IPC_A]
R105  RC0805FR-07100KL  [Yageo_RC0805_IPC_A]
R106  RC0805FR-07100KL  [Yageo_RC0805_IPC_A]
R107  10 OHM  [Yageo_RC0805_IPC_A]
R108  1K  [Yageo_RC0805_IPC_A]
R109  RC0805FR-07100KL  [Yageo_RC0805_IPC_A]
R110  RC0805FR-07100KL  [Yageo_RC0805_IPC_A]
R111  RC0805FR-07100KL  [Yageo_RC0805_IPC_A]
R112  RC0805FR-07100KL  [Yageo_RC0805_IPC_A]
R113  RC0805FR-07100KL  [Yageo_RC0805_IPC_A]
R114  33K  [Yageo_RC0805_IPC_A]
R115  RC0805FR-07100KL  [Yageo_RC0805_IPC_A]
R116  1K  [Yageo_RC0805_IPC_C]
R117  RES-CONST  [RES-3921]  (value not drawn)
R118  33K  [Yageo_RC0805_IPC_A]
R119  RC0805FR-07100KL  [Yageo_RC0805_IPC_A]
R120  RC0805FR-07100KL  [Yageo_RC0805_IPC_A]
R121  100K  [Yageo_RC0805_IPC_A]
RG1  Part Number: LM7805CT  [TO-220(bend_rad)]  (hidden comment: Reg_Fairchild_LM7805CT_eec)
RP1  10k  [Bourns_3296W_MFG]
RP2  10k  [Bourns_3296W_MFG]
RP3  10k  [Bourns_3296W_MFG]
RP4  10k  [Bourns_3296W_MFG]
TP1  Test_Point_PCB  [Test_Point]  (value not drawn)
TP2  Test_Point_PCB  [Test_Point]  (value not drawn)
TP3  Test_Point_PCB  [Test_Point]  (value not drawn)
TP4  Test_Point_PCB  [Test_Point]  (value not drawn)
TP5  Test_Point_PCB  [Test_Point]  (value not drawn)
TP6  Test_Point_PCB  [Test_Point]  (value not drawn)
TP7  Test_Point_PCB  [Test_Point]  (value not drawn)
TP8  Test_Point_PCB  [Test_Point]  (value not drawn)
TP9  Test_Point_PCB  [Test_Point]  (value not drawn)
TP10  Test_Point_PCB  [Test_Point]  (value not drawn)
TP11  Test_Point_PCB  [Test_Point]  (value not drawn)
TP12  Test_Point_PCB  [Test_Point]  (value not drawn)
TP13  Test_Point_PCB  [Test_Point]  (value not drawn)
TP14  Test_Point_PCB  [Test_Point]  (value not drawn)
TP15  Test_Point_PCB  [Test_Point]  (value not drawn)
TP16  Test_Point_PCB  [Test_Point]  (value not drawn)
TP17  Test_Point_PCB  [Test_Point]  (value not drawn)
TP18  Test_Point_PCB  [Test_Point]  (value not drawn)
TP19  Test_Point_PCB  [Test_Point]  (value not drawn)
TP20  Test_Point_PCB  [Test_Point]  (value not drawn)
TP21  Test_Point_PCB  [Test_Point]  (value not drawn)
TP22  Test_Point_PCB  [Test_Point]  (value not drawn)
TP23  Test_Point_PCB  [Test_Point]  (value not drawn)
TP24  Test_Point_PCB  [Test_Point]  (value not drawn)
TP25  Test_Point_PCB  [Test_Point]  (value not drawn)
TP26  Test_Point_PCB  [Test_Point]  (value not drawn)
TP27  Test_Point_PCB  [Test_Point]  (value not drawn)
TP28  Test_Point_PCB  [Test_Point]  (value not drawn)
TP29  Test_Point_PCB  [Test_Point]  (value not drawn)
TP30  Test_Point_PCB  [Test_Point]  (value not drawn)
TP31  Test_Point_PCB  [Test_Point]  (value not drawn)
TP32  Test_Point_PCB  [Test_Point]  (value not drawn)
TP33  Test_Point_PCB  [Test_Point]  (value not drawn)
TP34  Test_Point_PCB  [Test_Point]  (value not drawn)
TP35  Test_Point_PCB  [Test_Point]  (value not drawn)
TP36  Test_Point_PCB  [Test_Point]  (value not drawn)
TP37  Test_Point_PCB  [Test_Point]  (value not drawn)
TP38  Test_Point_PCB  [Test_Point]  (value not drawn)
TP39  Test_Point_PCB  [Test_Point]  (value not drawn)
TP40  Test_Point_PCB  [Test_Point]  (value not drawn)
TP41  Test_Point_PCB  [Test_Point]  (value not drawn)
TP42  Test_Point_PCB  [Test_Point]  (value not drawn)
TP43  Test_Point_PCB  [Test_Point]  (value not drawn)
TP44  Test_Point_PCB  [Test_Point]  (value not drawn)
TP45  Test_Point_PCB  [Test_Point]  (value not drawn)
TP46  Test_Point_PCB  [Test_Point]  (value not drawn)
TP47  Test_Point_PCB  [Test_Point]  (value not drawn)
TP48  Test_Point_PCB  [Test_Point]  (value not drawn)
TP49  Test_Point_PCB  [Test_Point]  (value not drawn)
TP50  Test_Point_PCB  [Test_Point]  (value not drawn)
TP51  Test_Point_PCB  [Test_Point]  (value not drawn)
TP52  Test_Point_PCB  [Test_Point]  (value not drawn)
TP53  Test_Point_PCB  [Test_Point]  (value not drawn)
TP54  Test_Point_PCB  [Test_Point]  (value not drawn)
TP55  Test_Point_PCB  [Test_Point]  (value not drawn)
TP56  Test_Point_PCB  [Test_Point]  (value not drawn)
TP57  Test_Point_PCB  [Test_Point]  (value not drawn)
TP58  Test_Point_PCB  [Test_Point]  (value not drawn)
TP59  Test_Point_PCB  [Test_Point]  (value not drawn)
TP60  Test_Point_PCB  [Test_Point]  (value not drawn)
TP61  Test_Point_PCB  [Test_Point]  (value not drawn)
TP62  Test_Point_PCB  [Test_Point]  (value not drawn)
TP63  Test_Point_PCB  [Test_Point]  (value not drawn)
TP64  Test_Point_PCB  [Test_Point]  (value not drawn)
TP65  Test_Point_PCB  [Test_Point]  (value not drawn)
TP66  Test_Point_PCB  [Test_Point]  (value not drawn)
TP67  Test_Point_PCB  [Test_Point]  (value not drawn)
TP68  Test_Point_PCB  [Test_Point]  (value not drawn)
TP69  Test_Point_PCB  [Test_Point]  (value not drawn)
TP70  Test_Point_PCB  [Test_Point]  (value not drawn)
TP71  Test_Point_PCB  [Test_Point]  (value not drawn)
TP72  Test_Point_PCB  [Test_Point]  (value not drawn)
TP73  Test_Point_PCB  [Test_Point]  (value not drawn)
TP74  Test_Point_PCB  [Test_Point]  (value not drawn)
TP75  Test_Point_PCB  [Test_Point]  (value not drawn)
TP76  Test_Point_PCB  [Test_Point]  (value not drawn)
TP77  Test_Point_PCB  [Test_Point]  (value not drawn)
TP78  Test_Point_PCB  [Test_Point]  (value not drawn)
TP79  Test_Point_PCB  [Test_Point]  (value not drawn)
TP80  Test_Point_PCB  [Test_Point]  (value not drawn)
TP81  Test_Point_PCB  [Test_Point]  (value not drawn)
TP82  Test_Point_PCB  [Test_Point]  (value not drawn)
TP83  Test_Point_PCB  [Test_Point]  (value not drawn)
TP84  Test_Point_PCB  [Test_Point]  (value not drawn)
TP85  Test_Point_PCB  [Test_Point]  (value not drawn)
TP86  Test_Point_PCB  [Test_Point]  (value not drawn)
TP87  Test_Point_PCB  [Test_Point]  (value not drawn)
TP88  Test_Point_PCB  [Test_Point]  (value not drawn)
TP89  Test_Point_PCB  [Test_Point]  (value not drawn)
TP90  Test_Point_PCB  [Test_Point]  (value not drawn)
TP91  Test_Point_PCB  [Test_Point]  (value not drawn)
TP92  Test_Point_PCB  [Test_Point]  (value not drawn)
TP93  Test_Point_PCB  [Test_Point]  (value not drawn)
TP94  Test_Point_PCB  [Test_Point]  (value not drawn)
TP95  Test_Point_PCB  [Test_Point]  (value not drawn)
TP96  Test_Point_PCB  [Test_Point]  (value not drawn)
TP97  Test_Point_PCB  [Test_Point]  (value not drawn)
TP98  Test_Point_PCB  [Test_Point]  (value not drawn)
TP99  Test_Point_PCB  [Test_Point]  (value not drawn)
TP100  Test_Point_PCB  [Test_Point]  (value not drawn)
TP101  Test_Point_PCB  [Test_Point]  (value not drawn)
TP102  Test_Point_PCB  [Test_Point]  (value not drawn)
TP103  Test_Point_PCB  [Test_Point]  (value not drawn)
TP104  Test_Point_PCB  [Test_Point]  (value not drawn)
TP105  Test_Point_PCB  [Test_Point]  (value not drawn)
TP106  Test_Point_PCB  [Test_Point]  (value not drawn)
TP107  Test_Point_PCB  [Test_Point]  (value not drawn)
TP108  Test_Point_PCB  [Test_Point]  (value not drawn)
U1  STM32F303CCT6  [LQFP48-7x7mm]  (parts A,B of 2)
U2  ACS758  [ACS758-100]  (value not drawn)
U3  B0505S-1WR3  [FP-B0505S-1WR3-MFG]
U4  ADUM1401BRWZ  [ADI-RW-16_M]
U5  MAX485ECSA+  [SOIC127P600X175-8N]  (value not drawn)
U6  LM1117MPX-3.3/NOPB  [DCY0004A_L]
U7  IR2181  [SOIC8_INF-L]
U8  MCP6001  [SOT-23-5]  (value not drawn)
U9  MCP6001  [SOT-23-5]  (value not drawn)
U10  MCP6001  [SOT-23-5]  (value not drawn)
U11  IR2181  [SOIC8_INF-L]
U12  MCP6001  [SOT-23-5]
U13  MCP6001  [SOT-23-5]
U14  MCP6001  [SOT-23-5]
U15  MCP6001  [SOT-23-5]
U16  IR2181  [SOIC8_INF-L]
VD1  15V  [DO-017AA]
VD2  LED  [LED-0603]  (value not drawn)
VD3  DIODE  [DO201AB]  (value not drawn)
VD4  DIODE  [DO201AB]  (value not drawn)
VD5  DIODE  [DO201AB]  (value not drawn)
VD6  DIODE  [DO201AB]  (value not drawn)
VD7  DIODE  [DO201AB]  (value not drawn)
VD8  DIODE  [DO201AB]  (value not drawn)
Y1  FOXSLF/120-20  [FOX-FOXSLF-2_V]
ZD1  P6SMB16CA  [DO-214AA]  (value not drawn)
ZD2  P6SMB16CA  [DO-214AA]  (value not drawn)
ZD3  P6SMB16CA  [DO-214AA]  (value not drawn)
ZD4  P6SMB16CA  [DO-214AA]  (value not drawn)
ZD5  P6SMB16CA  [DO-214AA]  (value not drawn)
ZD6  P6SMB16CA  [DO-214AA]  (value not drawn)
ZD7  P6SMB16CA  [DO-214AA]  (value not drawn)
ZD8  P6SMB16CA  [DO-214AA]  (value not drawn)
ZD9  P6SMB16CA  [DO-214AA]  (value not drawn)

## Ports
+3.3V, ADC_2, ADC_3, ADC_4, BEMF_A, BEMF_B, BEMF_C, Diff3, Diff4, DIRECT, DIRECT (bidir), HALL_A, HALL_B, HALL_C, INP_1, INP_2, INP_3, INP_4, INTERUPT, LED_1, LED_2, LED_3, LED_4, LED_5, LED_6, Phaze_1, Phaze_2, Phaze_3, PWM_1_1, PWM_1_2, PWM_2_1, PWM_2_2, PWM_3_1, PWM_3_2, RESET (bidir), RX, RX (bidir), RX_1 (bidir), SCL, SDA, SENS_1, SENS_2, SENS_3, SWCLC, SWDIO, TIME_in_1, TX, TX (bidir), TX_1, TX_1 (bidir), ZERO

## Nets
+3V3: C32.1(+) C36.1 D13.1(C) J11.1 J12.1 L9.2 L10.2 P3.4 P5.4 P6.1 R13.2 R14.2 R46.1 R47.1 TP12.1(G9) TP36.1(G9) TP41.1(G9) ; port +3.3V
+3V3_All: C22.1(+) C23.1 C39.1 C40.1 C41.1 C42.1(+) C43.1(+) C44.1(+) C59.1 C60.1(+) C61.1 C62.1 C63.1(+) C64.1 C65.1(+) C66.1(+) L8.2 R61.1 R65.1 R67.1 R68.1 TP31.1(G9) U8.5(VDD) U9.5(VDD) U10.5(VDD) U12.5(VDD) U13.5(VDD) U14.5(VDD) U15.5(VDD)
+5V: C8.1 C20.1(+) C75.1 C76.1 D21.8(V+) J6.1 J11.2 L1.1 L7.2 P1.5 P2.5 P3.5 P4.3 P5.5 P7.3 P8.3 P9.3 P10.3 P11.3 P12.3 P13.3 P14.3 R90.2 R91.2 R111.2 RP1.1(CCW) RP2.1(CCW) RP3.1(CCW) RP4.1(CCW) TP90.1(G9) TP91.1(G9) U2.1(+VCC) U6.3(IN)
+5V_ISO: C10.1 R12.2 R15.2 R16.2 TP11.1(G9) U3.4(+Vo) U4.10(VE2) U4.16(VDD2) U5.8(VCC)
+5V_RS: C2.1(+) C3.1 L1.2 TP25.1(G9) U3.2(VIN) U4.1(VDD1) U4.7(VE1)
GND: BT1.1(-) C1.2 C2.2(-) C3.2 C4.2 C5.2 C6.2(-) C7.2(-) C8.2 C9.2 C11.2(-) C12.1 C13.1 C14.1 C15.2(-) C16.1 C17.2(-) C18.2(-) C19.1 C20.2(-) C21.2(-) C22.2(-) C23.2 C25.1 C27.1(C) C30.2(-) C31.2 C32.2(-) C33.2(-) C34.2(-) C35.2 C36.2 C37.2 C38.2 C39.2 C40.2 C41.2 C42.2(-) C43.2(-) C44.2(-) C46.2 C48.2 C50.1 C52.2 C54.2 C55.2 C56.2 C59.2 C60.2(-) C61.2 C62.2 C63.2(-) C64.2 C65.2(-) C66.2(-) C67.2 C68.2 C69.2 C71.1 C75.2 C76.2 C77.2 D1.2(K) D2.2(K) D3.2(K) D4.2(K) D5.2(K) D6.2(K) D7.2(K) D10.2(A) D12.2(K) D13.2(A) D21.4(V-) J2.2 J3.1 J4.1 J6.2 J7.1 J11.6 J12.6 LED1.1(K) LED2.1(K) P1.1 P2.1 P3.1 P4.1 P5.1 P6.4 P7.1 P8.1 P9.1 P10.1 P11.1 P12.1 P13.1 P14.1 R9.2 R17.1 R19.1 R24.1 R28.1 R29.1 R33.1 R36.1 R37.1 R51.2 R53.2 R54.1 R55.2 R56.1 R59.1 R62.2 R64.1 R73.1 R79.2 R80.2 R81.2 R83.2 R84.2 R87.2 R97.1 R98.1 R104.2 R108.1 R109.1 R110.1 R117.1 R118.2 R120.1 R121.1 RG1.2(GND) RP1.3(CW) RP2.3(CW) RP3.3(CW) RP4.3(CW) U1.8(VSSA/VREF-) U1.23(VSS) U1.35(VSS) U1.47(VSS) U2.2(GND) U3.1(GND) U4.2(GND1) U4.8(GND1) U6.1(GND) U7.3(COM) U8.2(VSS) U9.2(VSS) U10.2(VSS) U11.3(COM) U12.2(VSS) U13.2(VSS) U14.2(VSS) U15.2(VSS) U16.3(COM) VD1.2(A) VD2.1(C) ZD3.1(A)
GND_2: C10.2 J5.2 R22.1 R23.1 TP26.1(G9) U3.3(0V) U4.9(GND2) U4.15(GND2) U5.5(GND) ZD1.1(A) ZD2.1(A)
V_BAT: C5.1 C6.1(+) C24.2 C26.1 C45.2 C51.1 C70.2 C72.1 L4.2 Q1.2(C) Q3.2(C) Q5.2(C) TP7.1(G9) VD3.2(A) VD5.2(A) VD7.2(A)
V_PS: C7.1(+) J1.2 L4.1 R7.2 R8.2 U2.5(-IP)
VCC: C15.1(+) C27.2(A) D10.1(C) J4.2 J7.2 L3.1 L5.1 L6.1 RG1.1(Input) TP10.1(G9) ZD3.2(A)
VCC_DRV_1: C11.1(+) C12.2 L6.2 TP14.1(G9)
VCC_DRV_2: C13.2 C17.1(+) C25.2 C50.2 D9.2(A) D16.2(A) L5.2 TP9.1(G9) TP30.1(G9) TP49.1(G9) U7.5(VCC) U11.5(VCC)
VCC_DRV_3: C14.2 C18.1 C71.2 D19.2(A) L3.2 TP8.1(G9) TP89.1(G9) U16.5(VCC)
ADC_2: R39.2 ; port ADC_2
ADC_3: R40.2 ; port ADC_3
ADC_4: C37.1 C67.1 C77.1 R35.1 R37.2 R42.2 R63.1 R73.2 R116.1 R121.2 TP42.1(G9) TP70.1(G9) TP108.1(G9) ; port ADC_4
BEMF_A: R61.2 TP80.1(G9) U1.32(PA11) U12.1(VOUT) ; port BEMF_A
BEMF_B: R67.2 TP82.1(G9) U1.46(PB9) U14.1(VOUT) ; port BEMF_B
BEMF_C: R65.2 TP79.1(G9) U1.28(PB15) U15.1(VOUT) ; port BEMF_C
Diff3: D21.2(IN-) R92.1 R111.1 R115.2 R120.2 RP4.2(WIPER) TP107.1(G9) ; port Diff3
Diff4: D21.6(IN-) R93.1 RP3.2(WIPER) TP106.1(G9) ; port Diff4
DIRECT: J11.5 R21.2 R24.2 TP18.1(G9) U1.40(PB4) U4.5(VIC) ; port DIRECT
HALL_A: R78.1 R83.1 TP78.1(G9) U1.25(PB12) ; port HALL_A
HALL_B: R85.1 R87.1 TP86.1(G9) U1.26(PB13) ; port HALL_B
HALL_C: R94.1 R104.1 TP96.1(G9) U1.27(PB14) ; port HALL_C
INP_1: C16.2 R7.1 R17.2 TP13.1(G9) U1.10(PA0) ; port INP_1
INP_2: C19.2 R10.1 R19.2 TP16.1(G9) U1.11(PA1) ; port INP_2
INP_3: R102.1 R110.2 TP99.1(G9) U1.12(PA2) ; port INP_3
INP_4: R101.1 R109.2 TP98.1(G9) U1.13(PA3) ; port INP_4
INTERUPT: R114.1 R118.1 TP103.1(G9) U1.20(PB2) ; port INTERUPT
LED_1: P1.4 R1.2 TP4.1(G9) U1.41(PB5) ; port LED_1
LED_2: P1.3 R2.2 TP5.1(G9) U1.2(PC13) ; port LED_2
LED_3: P1.2 R3.2 TP6.1(G9) U1.3(PC14-OSC32_IN) ; port LED_3
LED_4: P2.4 R4.2 TP1.1(G9) U1.4(PC15-OSC_OUT) ; port LED_4
LED_5: P2.3 R5.2 TP2.1(G9) U1.22(PB11) ; port LED_5
LED_6: P2.2 R6.2 R75.2 TP3.1(G9) U1.33(PA12) ; port LED_6
Phaze_1: C24.1 C28.1 C29.2 J8.1 Q1.3(E) Q2.2(C) R26.1 R66.1 TP35.1(G9) U7.6(VS) VD3.1(C) VD4.2(A) ZD4.1(A) ; port Phaze_1
Phaze_2: C45.1 C57.1 C58.2 J9.1 Q3.3(E) Q4.2(C) R45.1 R71.1 TP60.1(G9) U11.6(VS) VD5.1(C) VD6.2(A) ZD6.1(A) ; port Phaze_2
Phaze_3: C70.1 C73.1 C74.2 J10.1 Q5.3(E) Q6.2(C) R70.1 R88.1 TP97.1(G9) U16.6(VS) VD7.1(C) VD8.2(A) ZD8.1(A) ; port Phaze_3
PWM_1_1: R29.2 TP32.1(G9) U1.29(PA8) U7.1(HI_in) ; port PWM_1_1
PWM_1_2: R28.2 TP33.1(G9) U1.17(PA7) U7.2(LOW_in) ; port PWM_1_2
PWM_2_1: R56.2 TP56.1(G9) U1.30(PA9) U11.1(HI_in) ; port PWM_2_1
PWM_2_2: R54.2 TP55.1(G9) U1.18(PB0) U11.2(LOW_in) ; port PWM_2_2
PWM_3_1: R98.2 TP92.1(G9) U1.31(PA10) U16.1(HI_in) ; port PWM_3_1
PWM_3_2: R97.2 TP93.1(G9) U1.19(PB1) U16.2(LOW_in) ; port PWM_3_2
RESET: C9.1 R34.1 U1.7(NRST) ; port RESET
RX: J11.3 R13.1 TP22.1(G9) U1.38(PA15) U4.6(VOD) ; port RX
RX_1: J12.5 ; port RX_1
SCL: P3.2 P5.2 R47.2 TP65.1(G9) U1.45(PB8) ; port SCL
SDA: P3.3 P5.3 R46.2 TP64.1(G9) U1.43(PB7) ; port SDA
SENS_1: C52.1 R41.1 TP44.1(G9) U1.14(PA4) ; port SENS_1
SENS_2: C56.1 R43.1 TP45.1(G9) U1.15(PA5) ; port SENS_2
SENS_3: C55.1 R44.1 TP52.1(G9) U1.16(PA6) ; port SENS_3
SWCLC: J12.3 P6.3 U1.37(PA14) ; port SWCLC
SWDIO: J12.2 P6.2 U1.34(PA13) ; port SWDIO
TIME_in_1: R60.1 R62.1 TP67.1(G9) U1.21(PB10) ; port TIME_in_1
TX: J11.4 R14.1 TP19.1(G9) U1.39(PB3) U4.4(VIB) ; port TX
TX_1: J12.4 U1.42(PB6) ; port TX_1
ZERO: R69.1 R72.1 R74.1 R77.2 TP77.1(G9) TP81.1(G9) TP83.1(G9) TP84.1(G9) U12.4(VIN-) U14.4(VIN-) U15.4(VIN-) ; port ZERO
NetBT1_2: BT1.2(+) D14.1(C) U1.1(VBAT)
NetC1_1: C1.1 U1.5(PF0-OSC_IN) Y1.2
NetC4_1: C4.1 U1.6(PF1-OSC_OUT) Y1.1
NetC21_1: C21.1(+) L7.1 RG1.3(Output) TP27.1(G9)
NetC26_2: C26.2 C29.1 Q2.3(E) R35.2 R36.2 TP38.1(G9) TP39.1(G9) VD4.1(C) ZD5.1(A)
NetC28_2: C28.2 D9.1(C) TP29.1(G9) U7.8(VB)
NetC30_1: C30.1(+) C31.1 L8.1 L9.1 R31.2 TP34.1(G9) U6.2(OUT) U6.4(TAB)
NetC33_1: C33.1(+) C34.1(+) C35.1 C38.1 D14.2(A) L10.1 R34.2 TP40.1(G9) U1.9(VDDA/VREF+) U1.24(VDD) U1.36(VDD) U1.48(VDD)
NetC46_1: C46.1 R39.1 TP50.1(G9) U8.3(VIN+)
NetC47_1: C47.1 R49.2 R51.1 TP57.1(G9) U8.4(VIN-)
NetC47_2: C47.2 R41.2 R49.1 TP53.1(G9) TP61.1(G9) U8.1(VOUT)
NetC48_1: C48.1 R40.1 TP48.1(G9) U9.3(VIN+)
NetC49_1: C49.1 R50.2 R53.1 TP58.1(G9) U9.4(VIN-)
NetC49_2: C49.2 R43.2 R50.1 TP54.1(G9) TP62.1(G9) U9.1(VOUT)
NetC51_2: C51.2 C58.1 Q4.3(E) R63.2 R64.2 TP68.1(G9) TP69.1(G9) VD6.1(C) ZD7.1(A)
NetC53_1: C53.1 R52.2 R55.1 TP59.1(G9) U10.4(VIN-)
NetC53_2: C53.2 R44.2 R52.1 TP51.1(G9) TP63.1(G9) U10.1(VOUT)
NetC54_1: C54.1 R42.1 TP47.1(G9) U10.3(VIN+)
NetC57_2: C57.2 D16.1(C) TP46.1(G9) U11.8(VB)
NetC68_1: C68.1 R75.1 R76.2 TP74.1(G9)
NetC69_1: C69.1 R76.1 TP75.1(G9) U13.3(VIN+)
NetC72_2: C72.2 C74.1 Q6.3(E) R116.2 R117.2 TP104.1(G9) TP105.1(G9) VD8.1(C) ZD9.1(A)
NetC73_2: C73.2 D19.1(C) TP88.1(G9) U16.8(VB)
NetD1_1: D1.1(A) R5.1
NetD2_1: D2.1(A) R1.1
NetD3_1: D3.1(A) R2.1
NetD4_1: D4.1(A) R3.1
NetD5_1: D5.1(A) R4.1
NetD6_1: D6.1(A) R6.1
NetD7_1: D7.1(A) R21.1
NetD8_1: D8.1(C) R25.1 R27.2 TP28.1(G9)
NetD8_2: D8.2(A) Q1.1(G) R25.2 R26.2 ZD4.2(A)
NetD11_1: D11.1(C) R30.1 R32.2 TP37.1(G9)
NetD11_2: D11.2(A) Q2.1(G) R32.1 R33.2 ZD5.2(A)
NetD12_1: D12.1(A) R31.1
NetD15_1: D15.1(C) R38.1 R48.2 TP43.1(G9)
NetD15_2: D15.2(A) Q3.1(G) R38.2 R45.2 ZD6.2(A)
NetD17_1: D17.1(C) R57.1 R58.2 TP66.1(G9)
NetD17_2: D17.2(A) Q4.1(G) R58.1 R59.2 ZD7.2(A)
NetD18_1: D18.1(C) R86.1 R89.2 TP87.1(G9)
NetD18_2: D18.2(A) Q5.1(G) R86.2 R88.2 ZD8.2(A)
NetD20_1: D20.1(C) R103.1 R107.2 TP102.1(G9)
NetD20_2: D20.2(A) Q6.1(G) R107.1 R108.2 ZD9.2(A)
NetD21_1: D21.1(OUT) R92.2 R100.2 R102.2 TP95.1(G9)
NetD21_3: D21.3(IN+) R91.1 RP2.2(WIPER) TP101.1(G9)
NetD21_5: D21.5(IN+) R90.1 R95.2 R105.2 RP1.2(WIPER) TP100.1(G9)
NetD21_7: D21.7(OUT) R99.2 R101.2 TP94.1(G9)
NetJ1_1: J1.1 L2.1
NetJ2_1: J2.1 L2.2
NetJ3_2: J3.2 U2.4(+IP)
NetJ5_1: J5.1 R22.2 TP24.1(G9) U5.7(B) ZD2.2(A)
NetJ5_3: J5.3 R12.1 TP20.1(G9) U5.6(A) ZD1.2(A)
NetLED1_2: LED1.2(A) R100.1
NetLED2_2: LED2.2(A) R99.1
NetP4_2: P4.2 R60.2
NetP7_2: P7.2 R78.2
NetP8_2: P8.2 R85.2
NetP9_2: P9.2 R95.1
NetP10_2: P10.2 R96.2
NetP11_2: P11.2 R94.2
NetP12_2: P12.2 R112.2
NetP13_2: P13.2 R115.1
NetP14_2: P14.2 R114.2
NetR8_1: R8.1 R11.2 VD1.1(C)
NetR9_1: R9.1 U1.44(BOOT0)
NetR10_2: R10.2 TP15.1(G9) U2.3(OUT)
NetR11_1: R11.1 VD2.2(A)
NetR15_1: R15.1 R20.1 TP23.1(G9) U5.1(RO)
NetR16_1: R16.1 R18.1 TP17.1(G9) U5.4(DI)
NetR18_2: R18.2 U4.13(VOB)
NetR20_2: R20.2 U4.11(VID)
NetR23_2: R23.2 TP21.1(G9) U4.12(VOC) U5.2(~{RE}) U5.3(DE)
NetR27_1: R27.1 U7.7(HO)
NetR30_2: R30.2 U7.4(LO)
NetR48_1: R48.1 U11.7(HO)
NetR57_2: R57.2 U11.4(LO)
NetR66_2: R66.2 R69.2 R79.1 TP71.1(G9) U12.3(VIN+)
NetR68_2: R68.2 R82.2 R84.1 TP85.1(G9) U13.4(VIN-)
NetR70_2: R70.2 R72.2 R80.1 TP72.1(G9) U15.3(VIN+)
NetR71_2: R71.2 R74.2 R81.1 TP73.1(G9) U14.3(VIN+)
NetR77_1: R77.1 R82.1 TP76.1(G9) U13.1(VOUT)
NetR89_1: R89.1 U16.7(HO)
NetR103_2: R103.2 U16.4(LO)

Not connected (* = marked no-connect by the designer): R93 2; R96 1; R105 1; R106 1 2; R112 1; R113 1 2; R119 1 2; U4 3(VIA) 14(VOA)

## Layout directives
net class HV: NetJ1_1, NetJ2_1, NetJ3_2, NetR8_1, Phaze_1, Phaze_2, Phaze_3, V_BAT, V_PS

## Notes on the sheet
- (in symbol ACS758) VCC
- (in symbol CMP-05427-000015-1) +
- (in symbol MCP6001T) +; -

## Library data of the parts
C1 C4 = CMP-2007-03453-2: Chip Multilayer Ceramic Capacitors for General Purpose, 0805, 16pF, X5R, 15%, 10%, 16V; Capacitance: 10uF; Radiation Hardening: No; Thickness: 0.053inch; Voltage Rating (DC): 16V; Lead Free: Lead Free; Package Quantity: 1; Width: 1.25mm; Case Code (Imperial): 0805; Depth: 1.25mm; Packaging: Tape and Reel; Dielectric: X5R; Max Operating Temperature: 85°C; Tolerance: 10%; Voltage Rating: 16V; Voltage: 16V; Height: 1.25mm; Case Code (Metric): 2012; Material: Ceramic; Mount: Surface Mount; Case/Package: 0805; REACH SVHC: No SVHC; Length: 2mm; Min Operating Temperature: -55°C; Termination: SMD/SMT
C2 C20-C22 C30 C32 C34 = 1000uF_10V_Size_F
C3 C8 C10 C23 C31 C35-C41 C46 C48 C52 C54-C56 C59 C61 C62 C64 C67 C68 C75-C77 = CMP-1036-04552-2: CAP CER 0.22UF 50V X7R 0805; Manufacturer: KEMET; Value: 0.22 μF; Temperature Coefficient: 30ppm/°C; Material: Ceramic; Tolerance: 0.1; ComponentLink2URL: https://content.kemet.com/datasheets/KEM_C1003_C0G_SMD.pdf; Temperature Characteristic: X7R; Device Class L3: Ceramic Capacitors; Lead Free: Yes; Temperature: -55°C to +125°C; RoHS: TRUE; Capacitance: 0.22 μF; Automotive: No; Octopart: https://octopart.com/c0805c224k5ractu-kemet-144670; Manufacturer Part Number: C0805C224K5RACTU; Temperature Range Low: -55°C; Height: 0.88mm; Device Class L1: Passive Components; Digikey Description: CAP CER 0.22UF 50V X7R 0805; ComponentLink2Description: Datasheet; Mouser Description: CAP CER 0.22UF 50V X7R 0805; Category: Cap; Ipc Land Pattern Name: CAPC200125X78; Temperature Range High: +125°C; Package: C0805C-DN; Device Class L2: Capacitors; Voltage Rating: 50 V
C5 = CMP-00287-17080245-1: ECQ-E2224JFW ECQE, Met Polyester Film Cap Radial Lead 250VDC, 0.22uF, 5%, L/S =10mm, Blk CRMP; Capacitance: 220nF; Voltage Rating (DC): 250V; Dielectric: PET; NexarPartId: 17080245; Width: 5.5118mm; Length: 11.9888mm; Min Operating Temperature: -40°C; Termination: Radial; Height - Seated (Max): 15.494mm; Max Operating Temperature: 105°C; Lead Pitch: 10mm; Mount: Through Hole; RoHS: Compliant; Dielectric Material: Polyester; Tolerance: 5%; Case/Package: Radial
C9 C47 C49 C53 C69 = CMP-1036-04552-2: CAP CER 0.22UF 50V X7R 0805; Manufacturer: KEMET; Manufacturer Part Number: C0805C224K5RACTU; Value: 0.22 μF; Temperature Coefficient: 30ppm/°C; Material: Ceramic; Tolerance: 0.1; ComponentLink2URL: https://content.kemet.com/datasheets/KEM_C1003_C0G_SMD.pdf; Temperature Characteristic: X7R; Device Class L3: Ceramic Capacitors; Lead Free: Yes; Temperature: -55°C to +125°C; RoHS: TRUE; Capacitance: 0.22 μF; Automotive: No; Octopart: https://octopart.com/c0805c224k5ractu-kemet-144670; Temperature Range Low: -55°C; Height: 0.88mm; Device Class L1: Passive Components; Digikey Description: CAP CER 0.22UF 50V X7R 0805; ComponentLink2Description: Datasheet; Mouser Description: CAP CER 0.22UF 50V X7R 0805; Category: Cap; Ipc Land Pattern Name: CAPC200125X78; Temperature Range High: +125°C; Package: C0805C-DN; Device Class L2: Capacitors; Voltage Rating: 50 V
C11 C15 C17 C18 = CAP-POLAR
C12-C14 C24 C29 C45 C58 C70 C74 = CAP-NON-POLAR
C16 = CMP-1036-04552-2: CAP CER  2.2UF 50V X7R 0805; Manufacturer: KEMET; Manufacturer Part Number: C0805C224K5RACTU; Value: 0.22 μF; Temperature Coefficient: 30ppm/°C; Material: Ceramic; Tolerance: 0.1; ComponentLink2URL: https://content.kemet.com/datasheets/KEM_C1003_C0G_SMD.pdf; Temperature Characteristic: X7R; Device Class L3: Ceramic Capacitors; Lead Free: Yes; Temperature: -55°C to +125°C; RoHS: TRUE; Capacitance: 0.22 μF; Automotive: No; Octopart: https://octopart.com/c0805c224k5ractu-kemet-144670; Temperature Range Low: -55°C; Height: 0.88mm; Device Class L1: Passive Components; Digikey Description: CAP CER 0.22UF 50V X7R 0805; ComponentLink2Description: Datasheet; Mouser Description: CAP CER 0.22UF 50V X7R 0805; Category: Cap; Ipc Land Pattern Name: CAPC200125X78; Temperature Range High: +125°C; Package: C0805C-DN; Device Class L2: Capacitors; Voltage Rating: 50 V
C19 = CMP-1036-04552-2: CAP CER 2.2UF 50V X7R 0805; Manufacturer: KEMET; Manufacturer Part Number: C0805C224K5RACTU; Value: 0.22 μF; Temperature Coefficient: 30ppm/°C; Material: Ceramic; Tolerance: 0.1; ComponentLink2URL: https://content.kemet.com/datasheets/KEM_C1003_C0G_SMD.pdf; Temperature Characteristic: X7R; Device Class L3: Ceramic Capacitors; Lead Free: Yes; Temperature: -55°C to +125°C; RoHS: TRUE; Capacitance: 0.22 μF; Automotive: No; Octopart: https://octopart.com/c0805c224k5ractu-kemet-144670; Temperature Range Low: -55°C; Height: 0.88mm; Device Class L1: Passive Components; Digikey Description: CAP CER 0.22UF 50V X7R 0805; ComponentLink2Description: Datasheet; Mouser Description: CAP CER 0.22UF 50V X7R 0805; Category: Cap; Ipc Land Pattern Name: CAPC200125X78; Temperature Range High: +125°C; Package: C0805C-DN; Device Class L2: Capacitors; Voltage Rating: 50 V
C27 = CMP-05427-000015-1: CAP ALUM 100UF 20% 50V SMD; Manufacturer: Panasonic; Automotive Grade: Grade 3; Leakage Current: 100uA; Dissipation Factor: 0.12%; Life: 2000Hours; Ripple Current: 200mA; Material: Aluminum; ComponentLink2Description: Datasheet; Category: Cap; Voltage Rating: 50V; Value: 100uF; Octopart: https://octopart.com/eee-1ha101up-panasonic-55396734; Digikey Description: CAP ALUM 100UF 20% 50V SMD; Package: SF; RoHS: TRUE; Height: 10.5mm; ComponentLink2URL: https://industrial.panasonic.com/cdbs/www-data/pdf/RDE0000/ABA0000C1145.pdf; Tolerance: 20%; Mouser Description: Cap Aluminum Lytic 100uF 50V 20% (8 X 10.2mm) SMD 200mA 2000h 85C Automotive T/R; Device Class L2: Capacitors; Temperature Range High: +85°C; Lead Free: Yes; Device Class L3: Aluminum Electrolytic Capacitors; Device Class L1: Passive Components; Manufacturer Part Number: EEE-1HA101UP; Temperature: -40°C to +85°C; Automotive: Yes; Capacitance: 100uF; Voltage: 50V; Temperature Range Low: -40°C
C33 C42-C44 C60 C63 C65 C66 = 293D106X9050E2TE3: Capacitor Polarised; Manufacturer_Name: Vishay; Height: 4.3mm; Manufacturer_Part_Number: 293D106X9050E2TE3; Mouser Part Number: 74-293D106X9050E2TE3; Arrow Part Number: 293D106X9050E2TE3
  C33: Datasheet Link: http://www.vishay.com/doc?40002; Mouser Price/Stock: https://www.mouser.com/Search/Refine.aspx?Keyword=74-293D106X9050E2TE3; Arrow Price/Stock: https://www.arrow.com/en/products/293d106x9050e2te3/vishay
  C42-C44 C60 C63 C65 C66: Datasheet Link: http://www.vishay.com/docs/40002/293d.pdf; Mouser Price/Stock: https://www.mouser.co.uk/ProductDetail/Vishay-Sprague/293D106X9050E2TE3?qs=N31o%252Bt096gu9lsvzLRhHsg%3D%3D; Arrow Price/Stock: https://www.arrow.com/en/products/293d106x9050e2te3/vishay?region=nac
D1-D7 D12 = 151031YS06000: WURTH ELEKTRONIK - 151031YS06000 - LED, Yellow, Through Hole, T-1 (3mm), 30 mA, 2 V, 590 nm; Geometry.Height: 5.5mm; Manufacturer_Name: Wurth Elektronik; Manufacturer_Part_Number: 151031YS06000; Mouser Part Number: 710-151031YS06000; Mouser Price/Stock: https://www.mouser.co.uk/ProductDetail/Wurth-Elektronik/151031YS06000?qs=LlUlMxKIyB3xSYYW%252BcuBiQ%3D%3D; Arrow Part Number: *; Arrow Price/Stock: *; Mouser Testing Part Number: *; Mouser Testing Price/Stock: *; Datasheet Link: https://katalog.we-online.de/led/datasheet/151031YS06000.pdf
D8 D11 D14 D15 D17 D18 D20 = CMP-249167-000001-1: DIODE GEN PURP 75V 150MA SOD80; Manufacturer: Vishay Small Signal; Max Junction Temp: +175°C; Automotive Grade: Grade 0; Capacitance: 4pF; Peak Reverse Current: 5uA; Forward Current: 300mA; Max Repetitive Reverse Voltage: 100V; Max Surge Forward Current: 2A; Value: 4pF; ComponentLink2Description: Datasheet; Height: 1.6mm; ComponentLink2URL: http://www.vishay.com/docs/85557/ll4148.pdf; Category: Diode; Lead Free: Yes; Device Class L3: Rectifier Diodes; Reverse Voltage: 75V; Mouser Description: Diodes - General Purpose, Power, Switching 100 Volt 100mA; RoHS: TRUE; Temperature: to +175°C; Automotive: Yes; Octopart: https://octopart.com/ll4448-gs08-vishay+small+signal-40886; Digikey Description: DIODE GEN PURP 75V 150MA SOD80; Manufacturer Part Number: LL4448-GS08; Temperature Range High: +175°C; Device Class L1: Discrete Semiconductors; Device Class L2: Diodes; Package: 6.560-5005.01-4
D9 D16 D19 = CMP-12791-000009-1: DIODE GEN PURP 400V 1A SMA; Manufacturer: Diodes Inc.; Max Surge Forward Current: 30A; Peak Reverse Current: 5uA; Standoff Height: 0.05mm; Value: 20pF; Max Junction Temp: +150°C; Digikey Description: DIODE GEN PURP 400V 1A SMA; ComponentLink2URL: https://www.diodes.com/assets/Datasheets/ds16008.pdf; Device Class L1: Discrete Semiconductors; Mouser Description: Rectifiers 400V 1A; Manufacturer Part Number: US1G-13-F; Package: SMA; Height: 2.4mm; Automotive: No; Temperature Range High: +150°C; RoHS: TRUE; Lead Free: Yes; Temperature: -65°C to +150°C; Category: Diode; Octopart: https://octopart.com/us1g-13-f-diodes+inc.-334651; Temperature Range Low: -65°C; Forward Current: 1A; Footprint Url: https://www.diodes.com/assets/Package-Files/SMA.pdf; ComponentLink2Description: Datasheet; Reverse Voltage: 400V; Capacitance: 20pF; Device Class L3: Rectifier Diodes; Max Repetitive Reverse Voltage: 400V; Device Class L2: Diodes
D10 = CMP-02541-000001-1: DIODE ZENER 15V 1.3W DO41; Manufacturer: Vishay; Max Reverse Leakage Current: 0.5uA; Reverse Voltage: 11V; Max Zener Voltage: 15.6V; Zener Impedance: 15Ω; Max Junction Temp: +175°C; Power Dissipation: 1300mW; Automotive Grade: Grade 0; Device Class L3: Zener Diodes; Device Class L1: Discrete Semiconductors; Automotive: Yes; Mouser Description: Zener Diodes 15 Volt 1.3 Watt 5%; Lead Free: Yes; Height: 2.6mm; Octopart: https://octopart.com/bzx85c15-tap-vishay-55401762; Temperature: to +175°C; Digikey Description: DIODE ZENER 15V 1.3W DO41; ComponentLink2URL: http://www.vishay.com/docs/85607/bzx85.pdf; Device Class L2: Diodes; RoHS: TRUE; Temperature Range High: +175°C; ComponentLink2Description: Datasheet; Package: 6.561-5001.02-4; Manufacturer Part Number: BZX85C15-TAP; Category: Diode; Nom Zener Voltage: 15V
D13 = CMP-14400-000025-1: DIODE ZENER 5.1V 300MW SOD323
D21 = LMV358AIDR: Микросхема сдвоенный ОУ; ComponentDescription: =ComponentTypе+', '+Comment+', '+Package; ComponentTypе: Микросхема сдвоенный ОУ; Package: 8-SOIC
J2 J4 J6 J7 = 691101710002: WR-TBL Series 101 Horizontal Entry Modular, THT, pitch 5mm, 2p; Manufacturer: Wurth Elektronik; Modularity: Yes; Rated Current: 16A; Working Voltage: 250V; ComponentLink1Description: Website Link; ComponentLink1URL: https://www.we-online.com/redexpert/article/691101710002?ad; ComponentLink2Description: Datasheet Link; ComponentLink2URL: https://www.we-online.com/redexpert/spec/691101710002?ad; Manufacturer Part Number: 691101710002; Category: Terminal Blocks; Match Code: WR-TBL; Mount: Through Hole; Operating Temperature Max: 105°C; Operating Temperature Min: -40°C; Packaging: Box; Application: Pressure Clamp; Number of Pins: 2; Number of Rows: 1; Orientation: Horizontal; Pitch: 5mm
J3 = Connector_Tianli_T-800
J5 = 691101710003: WR-TBL Series 101 Horizontal Entry Modular, Through Hole, pitch 5mm, 3p; Manufacturer: Wurth Elektronik; Pin Number: 3; Rated Current: 16A; Working Voltage: 250V; PCB/Cable/Panel: PCB; Modularity: Yes; ComponentLink1Description: Manufacturer Link; ComponentLink1URL: https://www.we-online.com/redexpert/article/691101710003?ad; ComponentLink2Description: Datasheet; ComponentLink2URL: https://www.we-online.com/redexpert/spec/691101710003?ad; Category: Terminal Blocks; Match Code: WR-TBL; Manufacturer Part Number: 691101710003; Mount: Through Hole; Operating Temperature Max: 105°C; Operating Temperature Min: -40°C; Packaging: Box; Pitch: 5mm; Orientation: Horizontal; Application: Pressure Clamp
J8-J10 = Connector_MEIGAN_MG136HT
L1 L3 L5-L10 = CMP-0227-00501-2: NexarPartId: 24533346; Inductance: 270µH; Current Rating: 620mA; Self Resonant Frequency: 4MHz; DC Resistance (DCR): 500mΩ; Ambient Temperature Range Low: -40°C; Min Operating Temperature: -40°C; RoHS: Compliant; Ambient Temperature Range High: 85°C; Packaging: Digi-Reel®; Height: 5.4mm; Length: 9mm; Max Operating Temperature: 125°C; Width: 10mm
LED1 LED2 = 151033BS03000: THT LED round mono-color waterclear, WL-TMRW , Blue; Manufacturer: Wuerth Elektronik; ComponentLink1Description: Manufacturer URL; ComponentLink2Description: Datasheet; ComponentLink1URL: http://www.we-online.com; ComponentLink2URL: http://katalog.we-online.de/pbs/datasheet/7448042001.pdfhttp://katalog.we-online.de/pbs/datasheet/7448042001.pdfhttp://katalog.we-online.de/pbs/datasheet/7448042001.pdfhttp://katalog.we-online.de/pbs/datasheet/151033BS03000.pdf; PartNumber: 151033BS03000; Emitting color: Blue; PackageReference: Type 3mm
P1-P3 P5 = 61300511121: WR-PHD Pin Header, THT, Vertical, pitch 2.54mm, 1 Row, 5P; Manufacturer: Wurth Elektronik; Contact Resistance: 20mΩ; Rated Current: 3A; Working Voltage: 250V; Withstanding Voltage: 500V; ComponentLink1Description: Website Link; ComponentLink1URL: https://www.we-online.com/redexpert/article/61300511121?ad; ComponentLink2Description: Datasheet Link; ComponentLink2URL: https://www.we-online.com/redexpert/spec/61300511121?ad; Manufacturer Part Number: 61300511121; Category: Board-to-Board Connectors; Match Code: WR-PHD; Mount: Through Hole; Operating Temperature Max: 105°C; Operating Temperature Min: -40°C; Packaging: Bag; Gender: Pin Header; Number of Pins: 5; Number of Rows: 1; Orientation: Vertical; Pitch: 2.54mm
P4 P7-P14 = 61900311121: WR-WTB THT Male Vertical Locking Header, pitch 2.54mm, 3p; Pin Number: 3; Contact Resistance: 20mOhm; Rated Current: 3A; Withstanding Voltage: 1000VAC; Working Voltage: 250VAC; ComponentLink1Description: Manufacturer; ComponentLink1URL: http://www.we-online.de; ComponentLink2Description: Datasheet; ComponentLink2URL: https://www.we-online.com/catalog/datasheet/61900311121.pdf; Pitch: 2.54mm; Published Date: January 2020; Publisher: Wurth Elektronik; Mounting Technology: THT; Packaging: Bag; Operating Temperature: -40 to +105degC; Part Number: 61900311121; Gender: Male; Type: Vertical
P6 = CMP-1024-00357-1: 0.025" SQ Post Header, Through-hole, Vertical, -55 to 125 degC, 2.54 mm Pitch, 4-Pin, Male, RoHS; Manufacturer: Samtec; Pitch: 2.54 mm; RoHS: True; ComponentLink3URL: http://www.samtec.com/documents/webfiles/cpdf/TSW-XXX-XX-XXX-X-XX-XXX-MKT.pdf; Mounting Technology: Through-hole; ComponentLink2URL: http://www.samtec.com/documents/webfiles/pdf/TSW_TH.PDF; ComponentLink1URL: http://www.samtec.com; ComponentLink3Description: Package Specification; PackageVersion: DM, 8/1988; ComponentLink2Description: Datasheet; PackageReference: TSW-104-08-X-S; PackageDescription: .025[0.64] SQ. Post Terminal Strip Assembly; PartNumber: TSW-104-08-G-S; ComponentLink1Description: Manufacturer URL; Temperature Range: -55 to 125 degC; DatasheetVersion: F-214; Orientation: Vertical
R1-R7 R9 R10 R12-R24 R26 R28-R35 R37 R39-R47 R49-R60 R62 R63 R66 R68-R81 R83-R85 R87 R88 R94 R97 R98 R103 R104 R107 R108 R114 R116 R118 R121 = RC0805FR-07100KL
R8 = RES-CONST
R11 = RC0805FR-07100KL: 220
R25 R27 R38 R48 R86 R89 = CMP-03412-028725-1: RES SMD 10 OHM 1% 1/8W 0805; Manufacturer Part Number: RT0805FRE0710RL; Manufacturer: Yageo; Tolerance: 0.0001; Value: 10Ω; Temperature Coefficient: 50 ppm/°C; Voltage Rating: 150V; Power Rating: 0.125W; Package: RT0805; Lead Free: Yes; Series: RT; Footprint Url: http://www.yageo.com/exep/pages/download/literatures/PYu-R_Mount_10.pdf; Temperature Range High: +155°C; Temperature Range Low: -55°C; Octopart: https://octopart.com/rt0805fre0710rl-yageo-39855890; Height: 0.6mm; Device Class L1: Passive Components; Mouser Description: High Precision-High Stability Chip Resistor Thin Film 0805 10Ohm 1% Paper T/R; ComponentLink2URL: http://www.yageo.com/documents/recent/PYu-RT_1-to-0.01_RoHS_L_9.pdf; Device Class L2: Resistors; Composition: Thin Film; Device Class L3: Chip SMD Resistors; Automotive: No; RoHS: TRUE; Ipc Land Pattern Name: RESC200125X50; Temperature: -55°C to +155°C; ComponentLink2Description: Datasheet; Resistance: 10Ω; Category: Res; Digikey Description: RES SMD 10 OHM 1% 1/8W 0805
R61 R65 R67 R82 = RC0805FR-07100KL: 100K
RG1 = Reg_Fairchild_LM7805CT_eec: REG IC REG LINEAR 5V 1A TO220AB; Voltage Dropout (Max): 2V @ 1A (Typ); Voltage - Input (Max): 35V; helpURL: https://upverter.com/upn/revision/b27a7358b7dd93a3/; ComponentLink2Description: Datasheet; Temperature: -40°C to +125°C; Package: TO220; Supplier 2: Mouser; Price: 0.384521982769; Supplier 1: Digi-Key; ComponentLink1URL: https://upverter.com/upn/revision/b27a7358b7dd93a3/; Supplier Part Number 2: 512-LM7805CT; Supplier Part Number 1: LM7805CT-ND; Manufacturer: Fairchild; ComponentLink1Description: Upverter; ComponentLink2URL: https://www.fairchildsemi.com/datasheets/LM/LM7805.pdf; RoHS: TRUE; Mouser Part Number: 512-LM7805CT; Ipc Land Pattern Name: TO-220; Temperature Range High: +125°C; Digikey Description: REG IC REG LINEAR 5V 1A TO220AB; Digikey Part Number: LM7805CT-ND; Lead Free: yes; Temperature Range Low: -40°C; Voltage - Output: 5V; Current-Output: 1A
RP1-RP4 = 3296W-1-202LF
TP1-TP108 = TP_PCB?: Test_Point
U1 = STM32F303CCT6: No Description Available; Mfr_Name: STMicroelectronics; RefDes: RefDes; Type: Type
U3 = B0505s-1W: DC DC Converter 5V 1W
U4 = CMP-0534-00565-1: Quad Channel Digital Isolator, 2.5 KV rms Insulation Rating, 10 Mbps Data Rate, 50 ns Delay, Industrial, 16-pin SOIC (RW-16), Tube; Manufacturer: Analog Devices; Max Data Rate: 10Mbps; ComponentLink2URL: http://www.analog.com/static/imported-files/data_sheets/ADuM1400_1401_1402.pdf; ComponentLink5Description: URL Link2; ComponentLink3URL: http://www.analog.com/static/imported-files/packages/PKG_PDF/SOIC_WIDE%20%28RW%29/RW_16.pdf; DatasheetVersion: Rev. H; ComponentLink2Description: Datasheet; ComponentLink3Description: Package Specification; PartNumber: ADUM1401BRWZ; ComponentLink5URL: Reference Circuit:http://www.analog.com/en/interface-isolation/digital-isolators/adum1401/products/product.html#product-recommendations; Max Operating Temp (degreesC): 125; PackageReference: RW-16; PackageVersion: 032707-B, 03/2007; ComponentLink1Description: Manufacturer URL; Code_JEDEC: MS-013-AA; PackageDescription: 16-Pin Standard Small Outline Package, Body 10.3 x 7.5 mm, Pitch 1.27 mm; Mounting Technology: Surface Mount; ComponentLink1URL: http://www.analog.com/en/index.html; ComponentLink4Description: URL Link1; ComponentLink4URL: Product URL:http://www.analog.com/en/interface-isolation/digital-isolators/adum1401/products/product.html
U6 = CMP-0062-01639-4: 800mA Low-Dropout Linear Regulator, 4-pin SOT-223, Pb-Free; Manufacturer: Texas Instruments; High-Reliability: Y; PowerWise: N; PackageTopMarking: XYTT*N05A; CompType: LDO IC; ComponentLink1URL: http://www.ti.com/general/docs/lit/getliterature.tsp?genericPartNumber=LM1117-N&fileType=pdf; PartNumber: LM1117MPX-3.3/NOPB; ComponentLink1Description: Datasheet URL; PinCount: 4; Code_JEDEC: TO-261-AA; PackageDescription: Molded SOT-223, 6.50 x 3.56 x 1.6mm Body, 4 Lead, 2.3mm Pitch; PackageReference: DCY0004A; RoHS: Y; Code_IPC: SOT223-4
U8-U10 U12-U15 = MCP6001T
VD1 = ZENER
Y1 = CMP-1749-00004-1: Resistance Weld Thru-Hole Crystal, 12 MHz, +/-30 ppm, -20 to 70 degC, 2-Pin THD, RoHS, Bulk; Elements: 1; Rds On Max: 115 mohm; Typical Rise Time: 90 ns; Max Power Dissipation: 2.5 W; Case\Package: TO-251-3; Input Capacitance: 350 pF; REACH SVHC: No SVHC; Length: 6.6 mm; ComponentLink1URL: http://www.foxonline.com/; PackageDescription: 2-Pin Through Hole Device, Body 11.35 x 4.65 mm, Pitch 4.88 mm; Radiation Hardening: No; Package Quantity: 70; Packaging: Rail/Tube; ComponentLink1Description: Manufacturer URL; Min Operating Temperature: -55 degC; Max Operating Temperature: 150 degC; RoHSCompliant: true; PackageReference: FOXSLF-2; DatasheetVersion: Mar-15; Pins: 3; Height: 6.1 mm; Mount: Through Hole; ComponentLink2URL: http://www.foxonline.com/pdfs/hc49slf.pdf; ComponentLink2Description: Datasheet; Width: 2.3 mm